# EAGLE design can_main_mb_v18_r4 (EAGLE 8.0.1)

## Sheet 1 of 2: can_main_mb_v18_r4
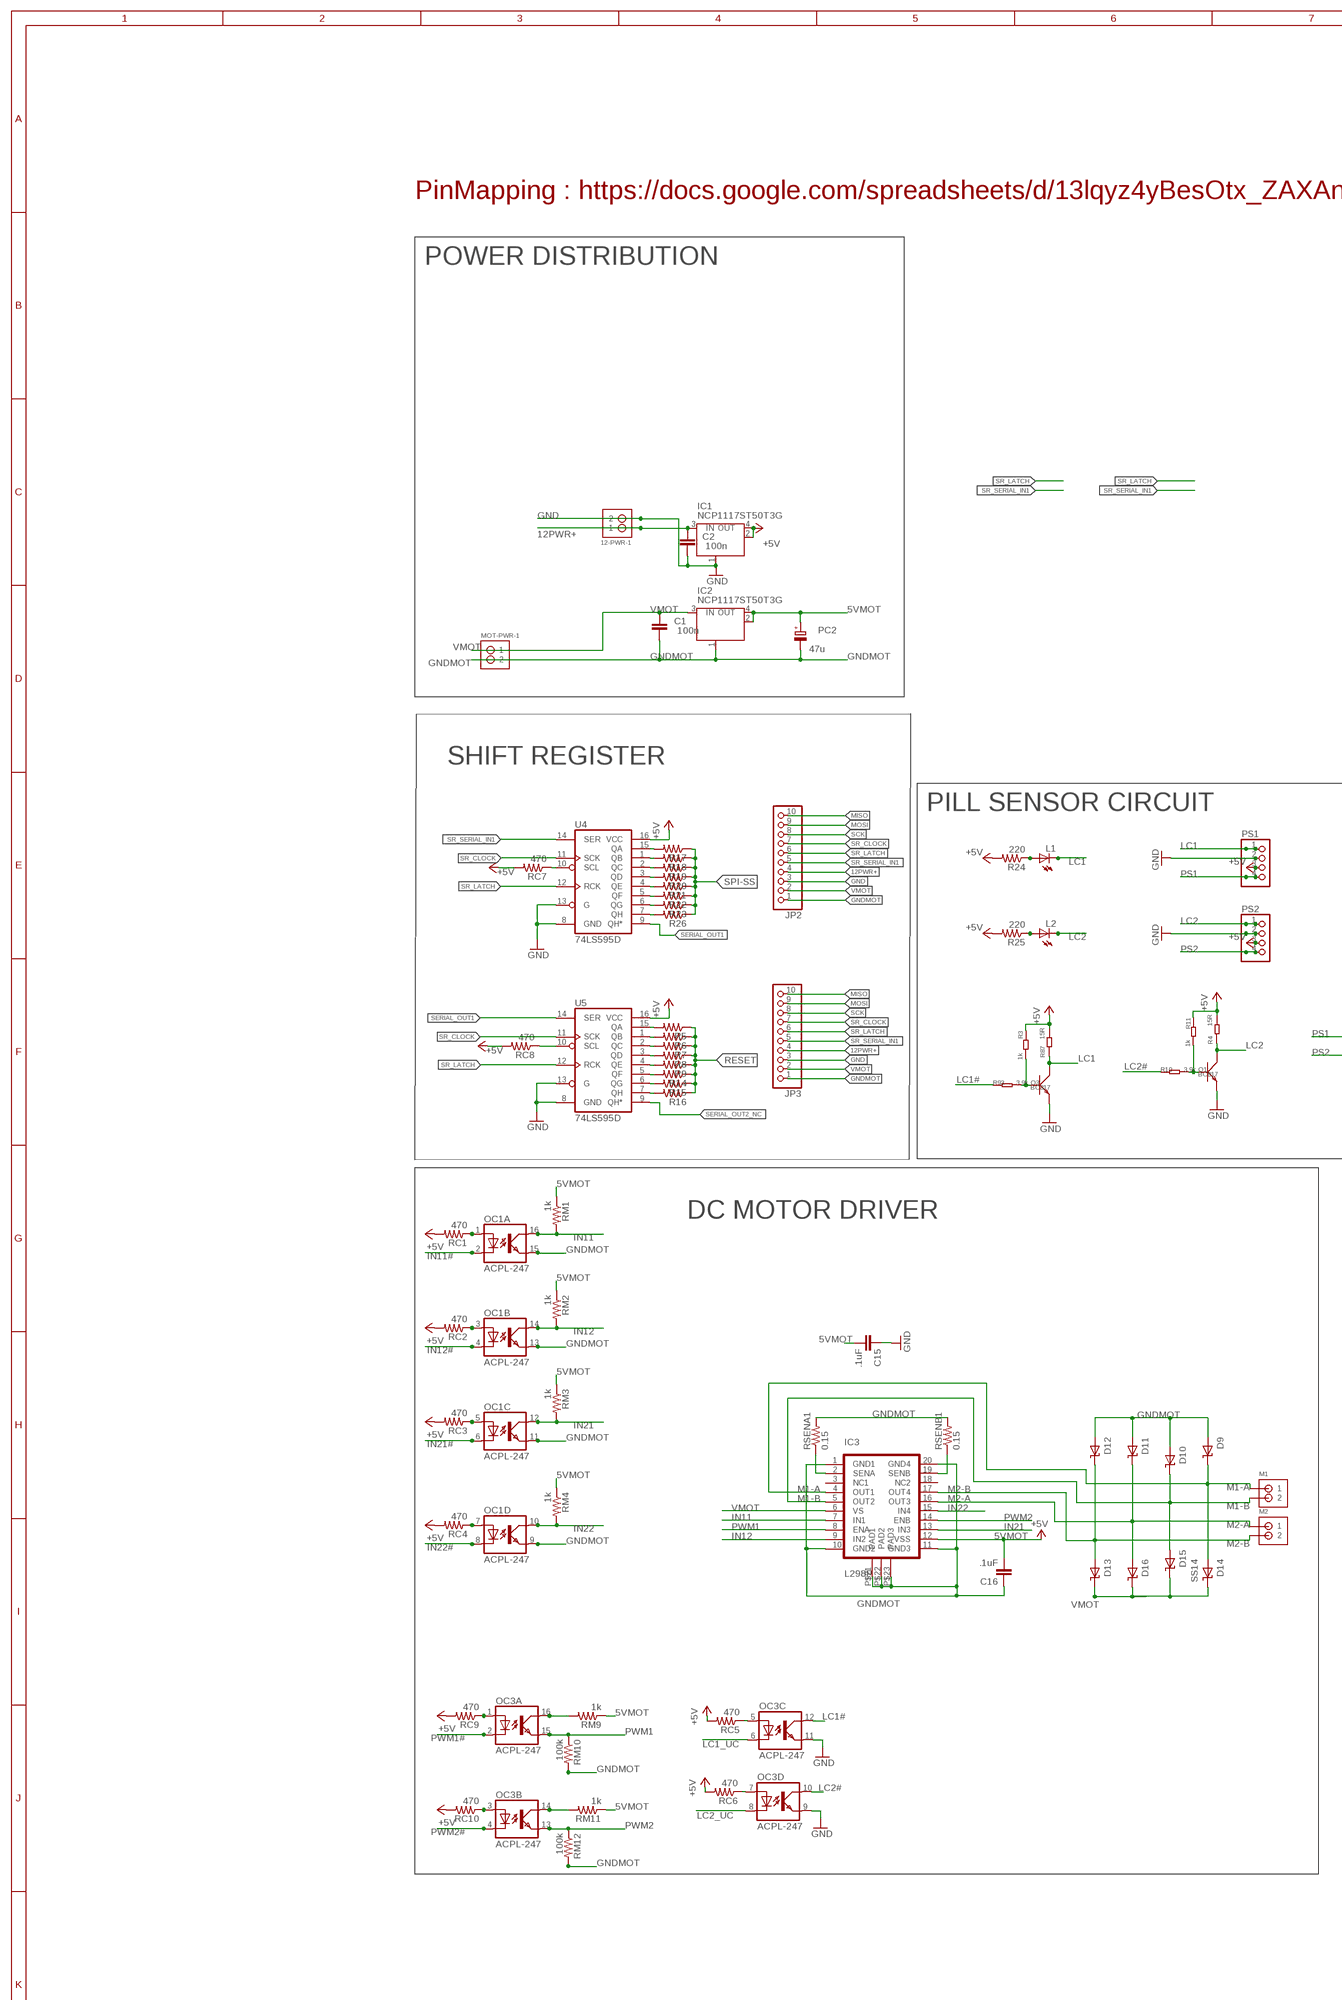
[diagram p0: schematic, sheet 1, part 1 of 3]
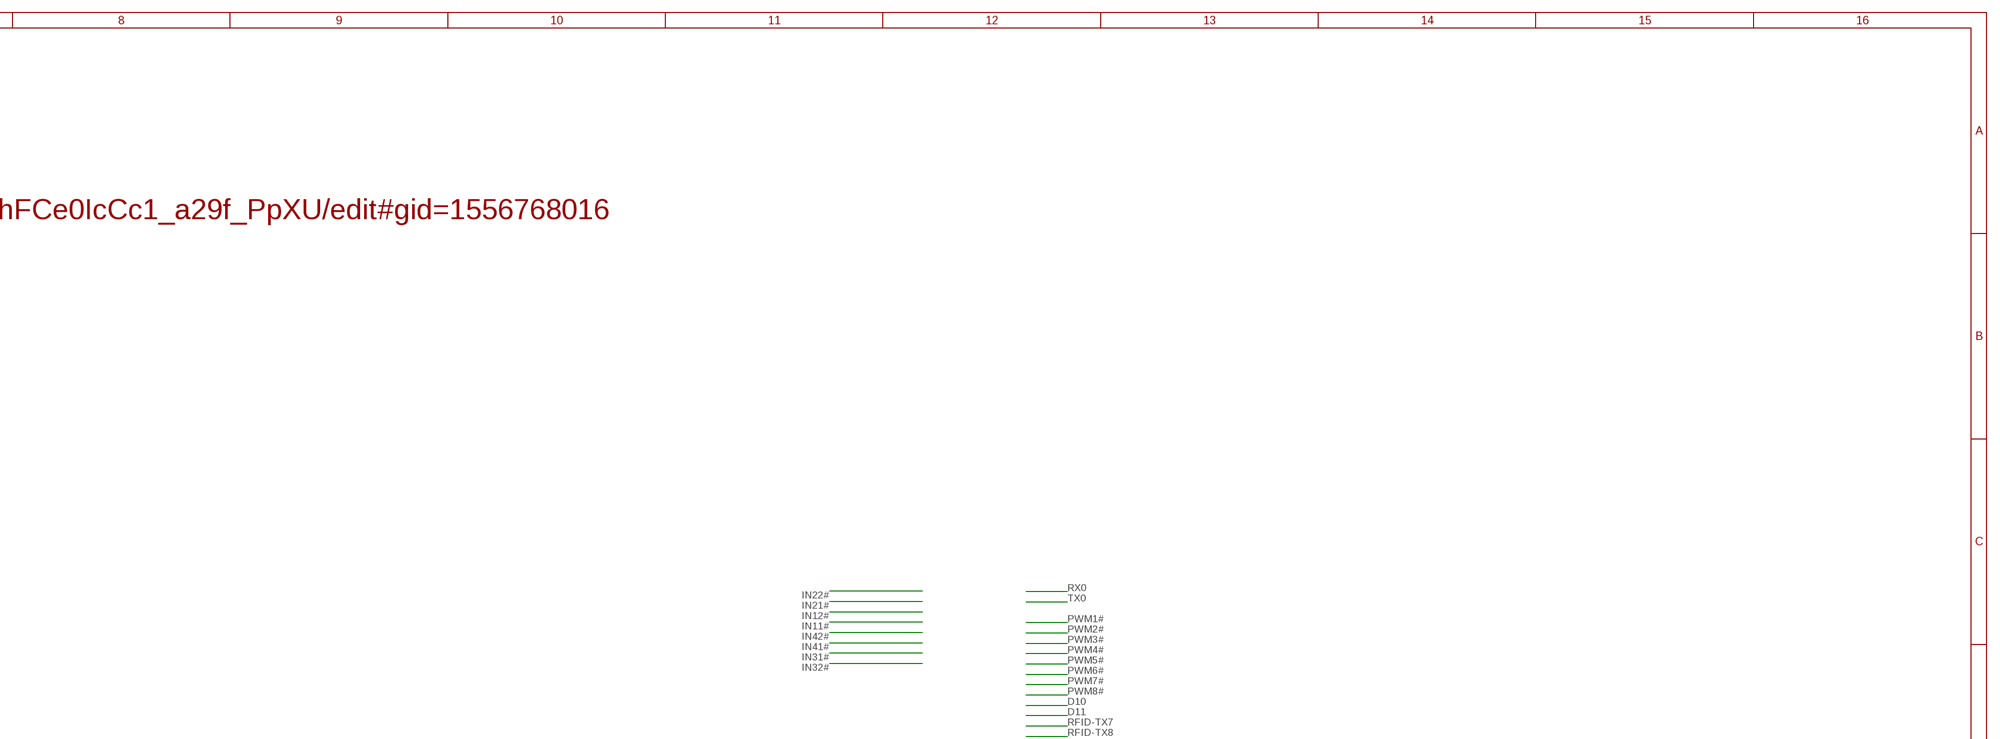
[diagram p1: schematic, sheet 1, part 2 of 3]
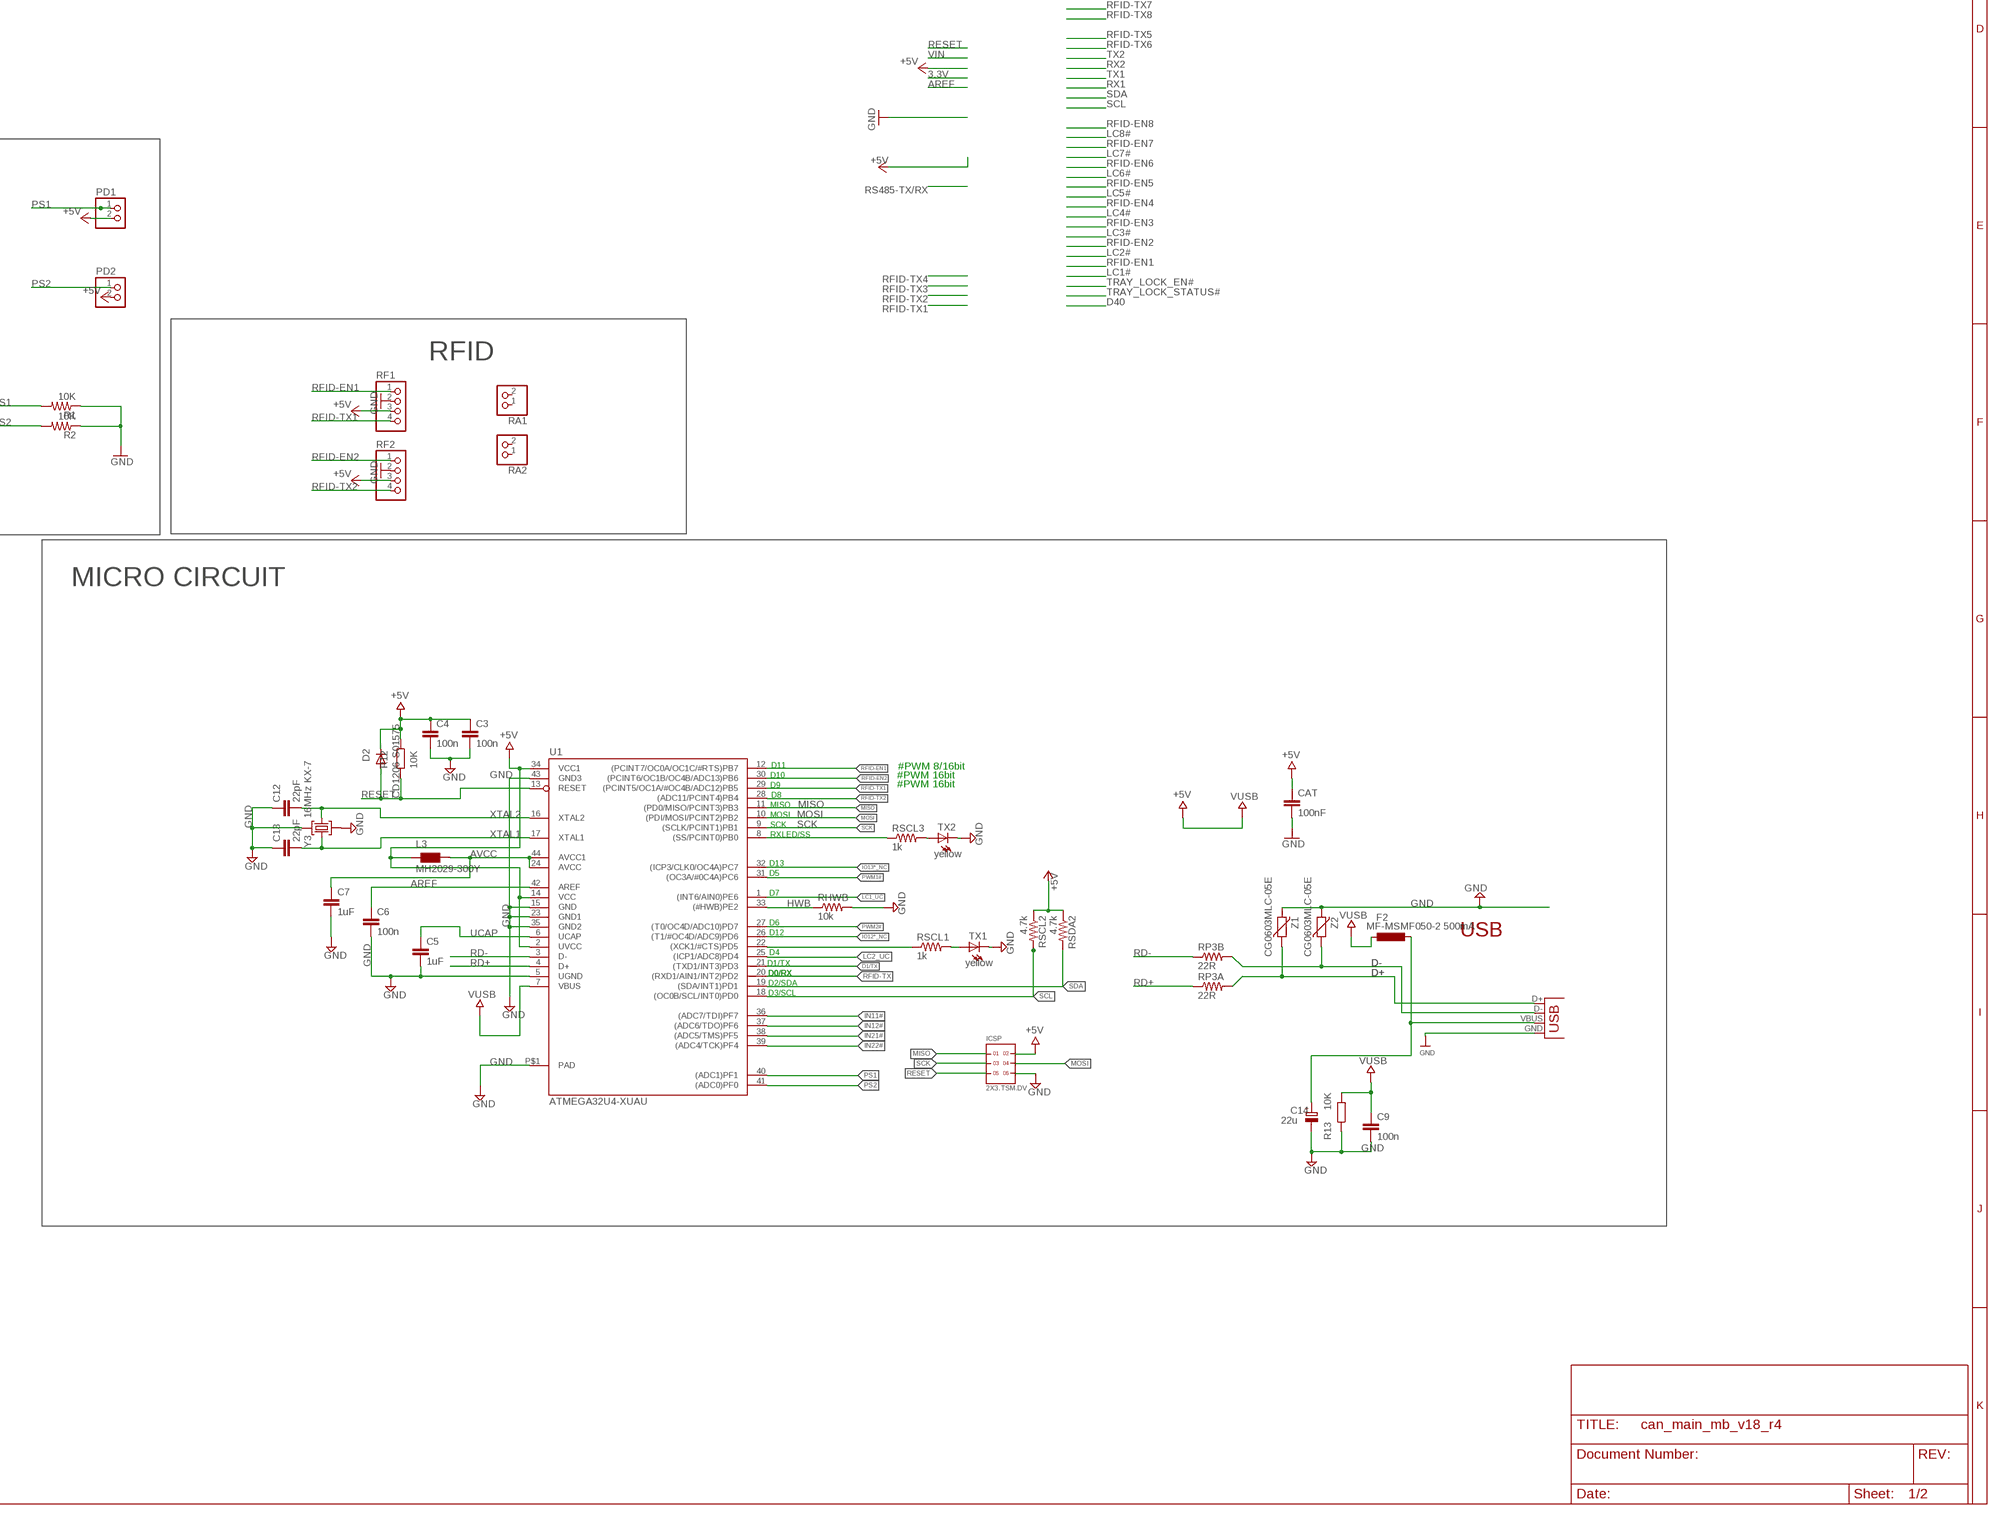
[diagram p2: schematic, sheet 1, part 3 of 3]

### Parts
12-PWR-1  JST-PH_2-PIN_HEADER  [JST_B2B-PH_HEADER]
C1  100n  C-EUC0603  [C0603]
C2  100n  C-EUC0603  [C0603]
C3  100n  C-EUC0603K  [C0603K]
C4  100n  C-EUC0603K  [C0603K]
C5  1uF  C-EUC0603K  [C0603K]
C6  100n  C-EUC0603K  [C0603K]
C7  1uF  C-EUC0603K  [C0603K]
C9  100n  C-EUC0603K  [C0603K]
C12  22pF  C-EUC0603K  [C0603K]
C13  22pF  C-EUC0603K  [C0603K]
C14  22u  CPOL-EUSMCC  [SMC_C]
C15  .1uF  CAP0402-CAP  [0402-CAP]
C16  .1uF  CAP0402-CAP  [0402-CAP]
CAT  100nF  CAP0603  [0603]
D2  CD1206-S01575  DIODE-MINIMELF  [MINIMELF]
D9  SS14  [SMA]
D10  SS14  [SMA]
D11  SS14  [SMA]
D12  SS14  [SMA]
D13  SS14  [SMA]
D14  SS14  [SMA]
D15  SS14  [SMA]
D16  SS14  [SMA]
F2  MF-MSMF050-2 500mA  L-EUL1812  [L1812]
IC1  NCP1117ST50T3G  MC33269ST-3.3T3  [SOT223]
IC2  NCP1117ST50T3G  MC33269ST-3.3T3  [SOT223]
IC3  L298P  [POWER-SO20]
ICSP  2X3.TSM.DV  [TSM-103-XX-XXX-DV-A]
JP1  USB  USBPTH-VERTICAL  [USB-B-PTH-VERTICAL]
JP2  PINHD-1X10  [1X10]
JP3  PINHD-1X10  [1X10]
L1  LED5MM  [LED5MM]
L2  LED5MM  [LED5MM]
L3  MH2029-300Y  WE-CBF_0805  [0805]
M1  JST-PH_2-PIN_HEADER  [JST_B2B-PH_HEADER]
M2  JST-PH_2-PIN_HEADER  [JST_B2B-PH_HEADER]
MOT-PWR-1  JST-PH_2-PIN_HEADER  [JST_B2B-PH_HEADER]
OC1  ACPL-247  [SOP16]
OC3  ACPL-247  [SOP16]
PC2  47u  CPOL-EUD  [PANASONIC_D]
PD1  PINHD-1X2  [1X02]
PD2  PINHD-1X2  [1X02]
PS1  PINHD-1X4  [1X04]
PS2  PINHD-1X4  [1X04]
Q1  BC817  TRANSISTOR-NPN-SOT23  [SOT23]
Q3  BC817  TRANSISTOR-NPN-SOT23  [SOT23]
R1  10K  R-US_R0603  [R0603]
R2  10K  R-US_R0603  [R0603]
R3  1k  R-0603  [R0603]
R4  15R  R-0603  [R0603]
R5  R-US_R0603  [R0603]
R6  R-US_R0603  [R0603]
R7  R-US_R0603  [R0603]
R8  R-US_R0603  [R0603]
R9  R-US_R0603  [R0603]
R10  3.9k  R-0603  [R0603]
R11  1k  R-0603  [R0603]
R12  10K  R-EU_R0603  [R0603-ROUND]
R13  10K  R-EU_R0603  [R0603-ROUND]
R14  R-US_R0603  [R0603]
R15  R-US_R0603  [R0603]
R16  R-US_R0603  [R0603]
R17  R-US_R0603  [R0603]
R18  R-US_R0603  [R0603]
R19  R-US_R0603  [R0603]
R20  R-US_R0603  [R0603]
R21  R-US_R0603  [R0603]
R22  R-US_R0603  [R0603]
R23  R-US_R0603  [R0603]
R24  220  R-US_R0603  [R0603]
R25  220  R-US_R0603  [R0603]
R26  R-US_R0603  [R0603]
R87  15R  R-0603  [R0603]
R93  3.9k  R-0603  [R0603]
RA1  PINHD-1X2  [1X02]
RA2  PINHD-1X2  [1X02]
RC1  470  R-US_R0603  [R0603]
RC2  470  R-US_R0603  [R0603]
RC3  470  R-US_R0603  [R0603]
RC4  470  R-US_R0603  [R0603]
RC5  470  R-US_R0603  [R0603]
RC6  470  R-US_R0603  [R0603]
RC7  470  R-US_R0603  [R0603]
RC8  470  R-US_R0603  [R0603]
RC9  470  R-US_R0603  [R0603]
RC10  470  R-US_R0603  [R0603]
RF1  PINHD-1X4  [1X04]
RF2  PINHD-1X4  [1X04]
RHWB  10k  R-US_R0603  [R0603]
RM1  1k  R-US_R0603  [R0603]
RM2  1k  R-US_R0603  [R0603]
RM3  1k  R-US_R0603  [R0603]
RM4  1k  R-US_R0603  [R0603]
RM9  1k  R-US_R0603  [R0603]
RM10  100k  R-US_R0603  [R0603]
RM11  1k  R-US_R0603  [R0603]
RM12  100k  R-US_R0603  [R0603]
RP3A  22R  R-US_R0603  [R0603]
RP3B  22R  R-US_R0603  [R0603]
RSCL1  1k  R-US_R0603  [R0603]
RSCL2  4.7k  R-US_R0603  [R0603]
RSCL3  1k  R-US_R0603  [R0603]
RSDA2  4.7k  R-US_R0603  [R0603]
RSENA1  0.15  R-US_R0603  [R0603]
RSENB1  0.15  R-US_R0603  [R0603]
TX1  yellow  LEDCHIPLED_0603  [CHIPLED_0603]
TX2  yellow  LEDCHIPLED_0603  [CHIPLED_0603]
U1  ATMEGA32U4-XUAU  [TQFP44-PAD]
U4  74LS595D  [SO16]
U5  74LS595D  [SO16]
Y3  16MHz KX-7  CRYSTAL-3.2-2.5  [CRYSTAL-3.2-2.5]
Z1  CG0603MLC-05E  VARISTORCN0603  [CT/CN0603]
Z2  CG0603MLC-05E  VARISTORCN0603  [CT/CN0603]

### Nets
5VMOT: C15.2 C16.2 IC2.2(OUT) IC2.4(OUT) IC3.P$12(VSS) PC2.+ RM1.1 RM2.1 RM3.1 RM4.1 RM9.1 RM11.1 ; supply symbol labelled +5V
12PWR+ [gnd]: 12-PWR-1.P1 C2.2 IC1.3(IN) JP2.4 JP3.4
+5V: C3.1 C4.1 C9.1 CAT.1 D2.C F2.2 IC1.2(OUT) IC1.4(OUT) ICSP.2 L3.1 PD1.2 PD2.2 PS1.3 PS2.3 R3.1 R4.2 R11.1 R12.1 R13.2 R24.2 R25.2 R87.2 RC1.2 RC2.2 RC3.2 RC4.2 RC5.2 RC6.2 RC7.2 RC8.2 RC9.2 RC10.2 RF1.3 RF2.3 RSCL2.1 RSDA2.1 U1.2(UVCC) U1.7(VBUS) U1.14(VCC) U1.34(VCC1) U4.16(VCC) U5.16(VCC) ; supply symbol labelled VUSB
AREF [motor]: C6.1 U1.42(AREF)
AVCC: C7.1 L3.2 U1.24(AVCC) U1.44(AVCC1)
D1/TX: U1.21((TXD1/INT3)PD3)
D+: JP1.D+ RP3A.2 Z1.1
D-: JP1.D- RP3B.2 Z2.1
GND [gnd]: 12-PWR-1.P2 C2.1 C3.2 C4.2 C5.2 C6.2 C7.2 C9.2 C12.1 C13.1 C14.- CAT.2 IC1.1(GND/ADJ) ICSP.6 JP1.GND JP2.3 JP3.3 OC3.9(D:EMIT) OC3.11(C:EMIT) PS1.2 PS2.2 Q1.2(E) Q3.2(E) R1.1 R2.1 R13.1 RF1.2 RF2.2 RHWB.2 TX1.C TX2.C U1.5(UGND) U1.15(GND) U1.23(GND1) U1.35(GND2) U1.43(GND3) U1.P$1(PAD) U4.8(GND) U4.13(G) U5.8(GND) U5.13(G) Y3.2(GND) Y3.4(GND) Z1.2 Z2.2
GNDMOT [gnd]: C1.1 C15.1 C16.1 D9.P$2(A) D10.P$2(A) D11.P$2(A) D12.P$2(A) IC2.1(GND/ADJ) IC3.P$1(GND1) IC3.P$10(GND2) IC3.P$11(GND3) IC3.P$20(GND4) IC3.P$21(PAD1) IC3.P$22(PAD2) IC3.P$23(PAD3) JP2.1 JP3.1 MOT-PWR-1.P2 OC1.9(D:EMIT) OC1.11(C:EMIT) OC1.13(B:EMIT) OC1.15(A:EMIT) PC2.- RM10.2 RM12.2 RSENA1.2 RSENB1.2 ; supply symbol labelled GND
HWB: RHWB.1 U1.33((#HWB)PE2)
IN11: IC3.P$7(IN1) OC1.16(A:COL) RM1.2
IN11#: OC1.2(A:C) U1.36((ADC7/TDI)PF7)
IN12: IC3.P$9(IN2) OC1.14(B:COL) RM2.2
IN12#: OC1.4(B:C) U1.37((ADC6/TDO)PF6)
IN21: IC3.P$13(IN3) OC1.12(C:COL) RM3.2
IN21#: OC1.6(C:C) U1.38((ADC5/TMS)PF5)
IN22: IC3.P$15(IN4) OC1.10(D:COL) RM4.2
IN22#: OC1.8(D:C) U1.39((ADC4/TCK)PF4)
IO12*_NC: U1.26((T1/#OC4D/ADC9)PD6)
IO13*_NC: U1.32((ICP3/CLK0/OC4A)PC7)
LC1: L1.K(C) PS1.1 Q3.3(C) R87.1
LC1#: OC3.12(C:COL) R93.1
LC1_UC: OC3.6(C:C) U1.1((INT6/AIN0)PE6)
LC2: L2.K(C) PS2.1 Q1.3(C) R4.1
LC2#: OC3.10(D:COL) R10.1
LC2_UC: OC3.8(D:C) U1.25((ICP1/ADC8)PD4)
M1-A [motor]: D9.P$1(K) D14.P$2(A) IC3.P$4(OUT1) M1.P1
M1-B [motor]: D10.P$1(K) D15.P$2(A) IC3.P$5(OUT2) M1.P2
M2-A [motor]: D11.P$1(K) D16.P$2(A) IC3.P$16(OUT3) M2.P1
M2-B [motor]: D12.P$1(K) D13.P$2(A) IC3.P$17(OUT4) M2.P2
MISO: ICSP.1 JP2.10 JP3.10 U1.11((PD0/MISO/PCINT3)PB3)
MOSI: ICSP.4 JP2.9 JP3.9 U1.10((PDI/MOSI/PCINT2)PB2)
N$1: OC1.3(B:A) RC2.1
N$2: OC1.5(C:A) RC3.1
N$3: OC3.5(C:A) RC5.1
N$4: OC1.7(D:A) RC4.1
N$5: RC8.1 U5.10(SCL)
N$6: OC3.7(D:A) RC6.1
N$7: Q1.1(B) R10.2 R11.2
N$8: RC7.1 U4.10(SCL)
N$9: OC3.1(A:A) RC9.1
N$10: OC3.3(B:A) RC10.1
N$11: RSCL1.1 U1.22((XCK1/#CTS)PD5)
N$12: R5.2 U5.15(QA)
N$13: L1.A R24.1
N$14: R6.2 U5.1(QB)
N$15: R7.2 U5.2(QC)
N$16: R8.2 U5.3(QD)
N$17: R16.2 U5.7(QH)
N$18: RSCL1.2 TX1.A
N$19: RSCL3.2 TX2.A
N$20: R15.2 U5.6(QG)
N$21: R9.2 U5.4(QE)
N$22: R17.2 U4.15(QA)
N$23: R18.2 U4.1(QB)
N$24: R19.2 U4.2(QC)
N$25: R20.2 U4.3(QD)
N$26: R26.2 U4.7(QH)
N$27: R23.2 U4.6(QG)
N$28: R21.2 U4.4(QE)
N$29: R14.2 U5.5(QF)
N$51: L2.A R25.1
N$56: OC3.16(A:COL) RM9.2
N$57: OC3.14(B:COL) RM11.2
N$117: OC1.1(A:A) RC1.1
N$317: Q3.1(B) R3.2 R93.2
PS1: PD1.1 PS1.4 R1.2 U1.40((ADC1)PF1)
PS2: PD2.1 PS2.4 R2.2 U1.41((ADC0)PF0)
PWM1: IC3.P$8(ENA) OC3.15(A:EMIT) RM10.1
PWM1#: OC3.2(A:C) U1.31((OC3A/#0C4A)PC6)
PWM2: IC3.P$14(ENB) OC3.13(B:EMIT) RM12.1
PWM2#: OC3.4(B:C) U1.27((T0/OC4D/ADC10)PD7)
RD+: RP3A.1 U1.4(D+)
RD-: RP3B.1 U1.3(D-)
RESET: D2.A ICSP.5 R5.1 R6.1 R7.1 R8.1 R9.1 R12.2 R14.1 R15.1 R16.1 U1.13(RESET)
RESET1: R22.2 U4.5(QF)
RFID-EN1: RF1.1 U1.12((PCINT7/OC0A/OC1C/#RTS)PB7)
RFID-EN2: RF2.1 U1.30((PCINT6/OC1B/OC4B/ADC13)PB6)
RFID-TX: U1.20((RXD1/AIN1/INT2)PD2)
RFID-TX1: RF1.4 U1.29((PCINT5/OC1A/#OC4B/ADC12)PB5)
RFID-TX2: RF2.4 U1.28((ADC11/PCINT4)PB4)
SCK: ICSP.3 JP2.8 JP3.8 U1.9((SCLK/PCINT1)PB1)
SCL: RSCL2.2 U1.18((OC0B/SCL/INT0)PD0)
SDA: RSDA2.2 U1.19((SDA/INT1)PD1)
SERIAL_OUT1: U4.9(QH*) U5.14(SER)
SERIAL_OUT2_NC: U5.9(QH*)
SNSA: IC3.P$2(SENA) RSENA1.1
SNSB: IC3.P$19(SENB) RSENB1.1
SPI-SS: R17.1 R18.1 R19.1 R20.1 R21.1 R22.1 R23.1 R26.1 RSCL3.1 U1.8((SS/PCINT0)PB0)
SR_CLOCK: JP2.7 JP3.7 U4.11(SCK) U5.11(SCK)
SR_LATCH: JP2.6 JP3.6 U4.12(RCK) U5.12(RCK)
SR_SERIAL_IN1: JP2.5 JP3.5 U4.14(SER)
UCAP: C5.1 U1.6(UCAP)
VMOT [0.6096]: C1.2 D13.P$1(K) D14.P$1(K) D15.P$1(K) D16.P$1(K) IC2.3(IN) IC3.P$6(VS) JP2.2 JP3.2 MOT-PWR-1.P1
VUSBD: C14.+ F2.1 JP1.VBUS
XTAL1: C13.2 U1.17(XTAL1) Y3.3(C2)
XTAL2: C12.2 U1.16(XTAL2) Y3.1(C1)
Unconnected: IC3.P$3(NC1) IC3.P$18(NC2) RA1.1 RA1.2 RA2.1 RA2.2

### Notes on the sheet
- PinMapping : https://docs.google.com/spreadsheets/d/13lqyz4yBesOtx_ZAXAn3Kk6hFCe0IcCc1_a29f_PpXU/edit#gid=1556768016
- POWER DISTRIBUTION
- SHIFT REGISTER
- PILL SENSOR CIRCUIT
- RFID
- MICRO CIRCUIT
- DC MOTOR DRIVER
- D11 | #PWM 8/16bit
- D10 | #PWM 16bit
- D9 | #PWM 16bit
- D8
- MISO
- MOSI
- SCK
- RXLED/SS
- D13
- D5
- D7
- D6
- D12 | USB
- D4
- D1/TX
- D0/RX | D0/RX
- D2/SDA
- D3/SCL

## Sheet 2 of 2: Notes
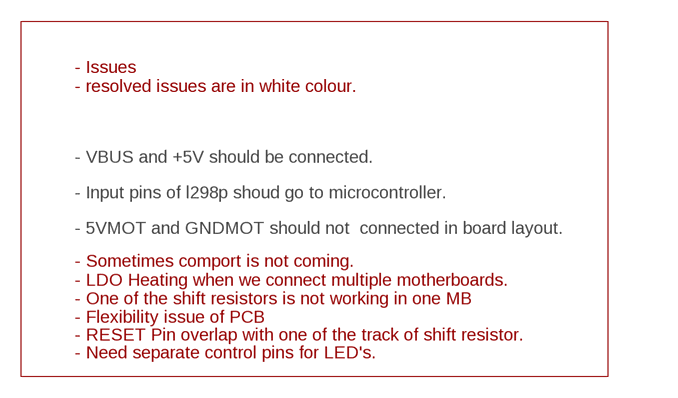
[diagram p3: schematic, sheet 2]

### Notes on the sheet
- - Issues
  - resolved issues are in white colour.
- - VBUS and +5V should be connected.
- - Input pins of l298p shoud go to microcontroller.
- - 5VMOT and GNDMOT should not  connected in board layout.
- - Sometimes comport is not coming.
  - LDO Heating when we connect multiple motherboards.
  - One of the shift resistors is not working in one MB
  - Flexibility issue of PCB
- - RESET Pin overlap with one of the track of shift resistor.
- - Need separate control pins for LED's.

## Library data of the parts
12-PWR-1 M1 M2 MOT-PWR-1 = SRG:JST-PH_2-PIN_HEADER: 2-pin JST PH Shrouded Header, top entry P/N B2B-PH-K-S Mating connector PHR-2 Mating cable assembly: Sparkfun PRT-09914 <http://www.sparkfun.com/products/9914>
C1 C2 = rcl:C-EU: CAPACITOR, European symbol
C3-C7 C9 C12 C13 = SmartPrj:C-EU: CAPACITOR, European symbol
C14 PC2 = rcl:CPOL-EU: POLARIZED CAPACITOR, European symbol
C15 C16 = SparkFun-Passives:CAP: Capacitor Standard 0603 ceramic capacitor, and 0.1" leaded capacitor.
CAT = SparkFun:CAP: Capacitor Standard 0603 ceramic capacitor, and 0.1" leaded capacitor.
D2 = diode:DIODE-: DIODE
D9-D16 = SmartPrj:SS14: DIODE SS14 Diode Schottky 1A 40v
F2 = rcl:L-EU: INDUCTOR, European symbol
IC1 IC2 = linear:MC33269ST*: Adjustable Output Low Dropout Voltage Regulator 800 mA Source: http://www.onsemi.com/pub/Collateral/MC33269-D.PDF
IC3 = SmartPrj:L298P: L298P DUAL FUL-BRIDGE DRIVER PowerSO20
ICSP = headers_samtec:2X3
JP1 = SparkFun-Connectors:USB: USB Connectors USB-B-PTH is fully proven SKU : PRT-00139/CONN-08278 USB-miniB is fully proven SKU : PRT-00587 USB-A-PCB is untested. USB-A-H is throughly reviewed, but untested. Spark Fun Electronics SKU : PRT-00437 USB-B-SMT is throughly reviewed, but untested. Needs silkscreen touching up. USB-A-S has not been used/tested USB-MB-H has not been used/tested USB-MICROB has been used. CONN-09505
JP2 JP3 = pinhead:PINHD-1X10: PIN HEADER
L1 L2 TX1 TX2 = led:LED: LED OSRAM: - CHIPLED LG R971, LG N971, LY N971, LG Q971, LY Q971, LO R971, LY R971 LH N974, LH R974 LS Q976, LO Q976, LY Q976 LO Q996 - Hyper CHIPLED LW Q18S LB Q993, LB Q99A, LB R99A - SideLED LS A670, LO A670, LY A670, LG A670, LP A670 LB A673, LV A673, LT A673, LW A673 LH A674 LY A675 LS A676, LA A676, LO A676, LY A676, LW A676 LS A679, LY A679, LG A679 - Hyper Micro SIDELED® LS Y876, LA Y876, LO Y876, LY Y876 LT Y87S - SmartLED LW L88C, LW L88S LB L89C, LB L89S, LG L890 LS L89K, LO L89K, LY L89K LS L896, LA L896, LO L896, LY L896 - TOPLED LS T670, LO T670, LY T670, LG T670, LP T670 LSG T670, LSP T670, LSY T670, LOP T670, LYG T670 LG T671, LOG T671, LSG T671 LB T673, LV T673, LT T673, LW T673 LH T674 LS T676, LA T676, LO T676, LY T676, LB T676, LH T676, LSB T676, LW T676 LB T67C, LV T67C, LT T67C, LS T67K, LO T67K, LY T67K, LW E67C LS E67B, LA E67B, LO E67B, LY E67B, LB E67C, LV E67C, LT E67C LW T67C LS T679, LY T679, LG T679 LS T770, LO T770, LY T770, LG T770, LP T770 LB T773, LV T773, LT T773, LW T773 LH T774 LS E675, LA E675, LY E675, LS T675 LS T776, LA T776, LO T776, LY T776, LB T776 LHGB T686 LT T68C, LB T68C - Hyper Mini TOPLED® LB M676 - Mini TOPLED Santana® LG M470 LS M47K, LO M47K, LY M47K Source: http://www.osram.convergy.de LUXEON: - LUMILED® LXK2-PW12-R00, LXK2-PW12-S00, LXK2-PW14-U00, LXK2-PW14-V00 LXK2-PM12-R00, LXK2-PM12-S00, LXK2-PM14-U00 LXK2-PE12-Q00, LXK2-PE12-R00, LXK2-PE12-S00, LXK2-PE14-T00, LXK2-PE14-U00 LXK2-PB12-K00, LXK2-PB12-L00, LXK2-PB12-M00, LXK2-PB14-N00, LXK2-PB14-P00, LXK2-PB14-Q00 LXK2-PR12-L00, LXK2-PR12-M00, LXK2-PR14-Q00, LXK2-PR14-R00 LXK2-PD12-Q00, LXK2-PD12-R00, LXK2-PD12-S00 LXK2-PH12-R00, LXK2-PH12-S00 LXK2-PL12-P00, LXK2-PL12-Q00, LXK2-PL12-R00 Source: www.luxeon.com KINGBRIGHT: KA-3528ASYC Source: www.kingbright.com
L3 = wuerth-elektronik:WE-CBF: SMD EMI Suppression Ferrite Beads - excellent anti-EMI properties - low DCR - impedances till 3000 ohms - rated current up to 6 A
OC1 OC3 = avago:ACPL-247
PD1 PD2 RA1 RA2 = pinhead:PINHD-1X2: PIN HEADER
PS1 PS2 RF1 RF2 = pinhead:PINHD-1X4: PIN HEADER
Q1 Q3 = Discrete:TRANSISTOR-NPN*: NPN audion
R1 R2 R5-R9 R14-R26 RC1-RC10 RHWB RM1-RM4 RM9-RM12 RP3A RP3B RSCL1-RSCL3 RSDA2 RSENA1 RSENB1 = resistor:R-US_: RESISTOR, American symbol
R3 R4 R10 R11 R87 R93 = Discrete:R*
R12 R13 = SmartPrj:R-EU_: RESISTOR, European symbol
U1 = SmartPrj:ATMEGA32U4-XU
U4 U5 = SparkFun:74*595: 8-bit SHIFT REGISTER, output latch
Y3 = SmartPrj:CRYSTAL-3.2-2.5
Z1 Z2 = varistor:VARISTOR: VARISTOR

## Net classes
0 default: width 0.254 mm, drill 0.254 mm, clearance 0.203 mm
1 power: width 0.635 mm, drill 0.584 mm, clearance 0.305 mm
2 gnd: width 0.406 mm, drill 0.305 mm, clearance 0.254 mm
3 power usb: width 0.508 mm, drill 0.406 mm, clearance 0.203 mm
4 motor: width 0.305 mm, drill 0.254 mm, clearance 0.203 mm
5 0.6096: width 0.61 mm, drill 0.406 mm, clearance 0.305 mm

## Board
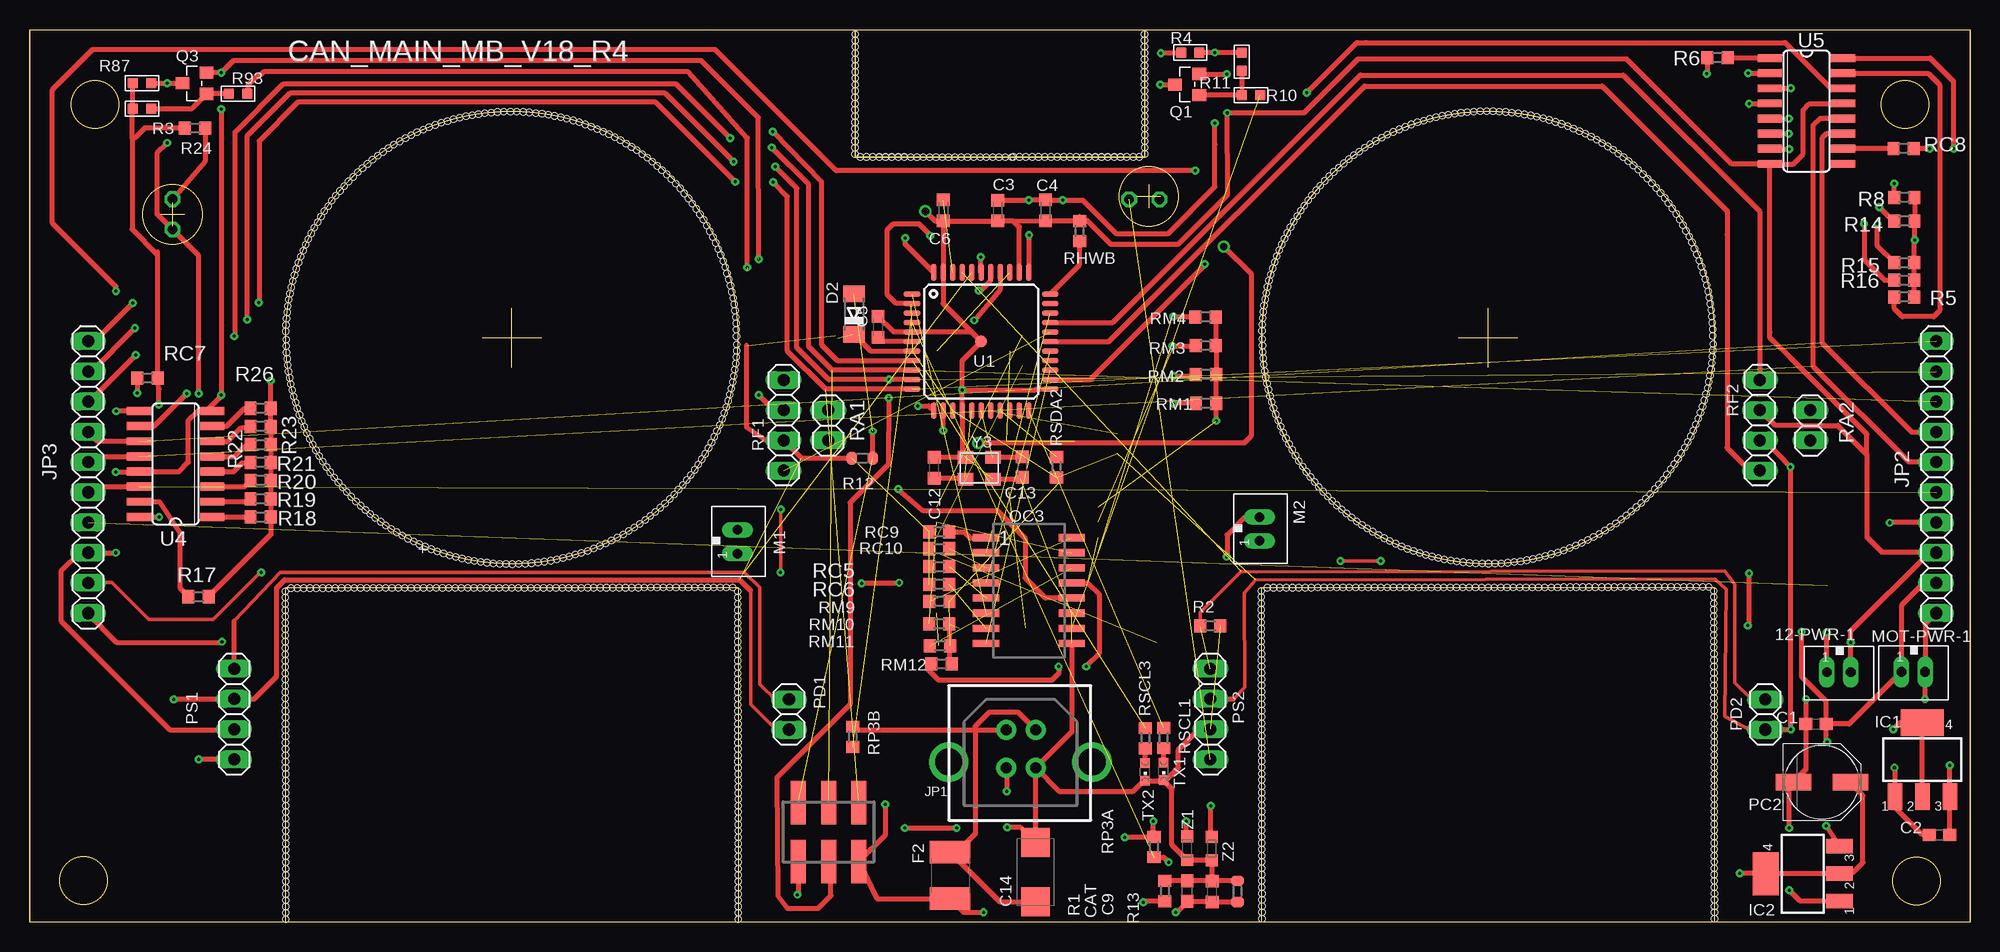
[diagram p4: board, top side]
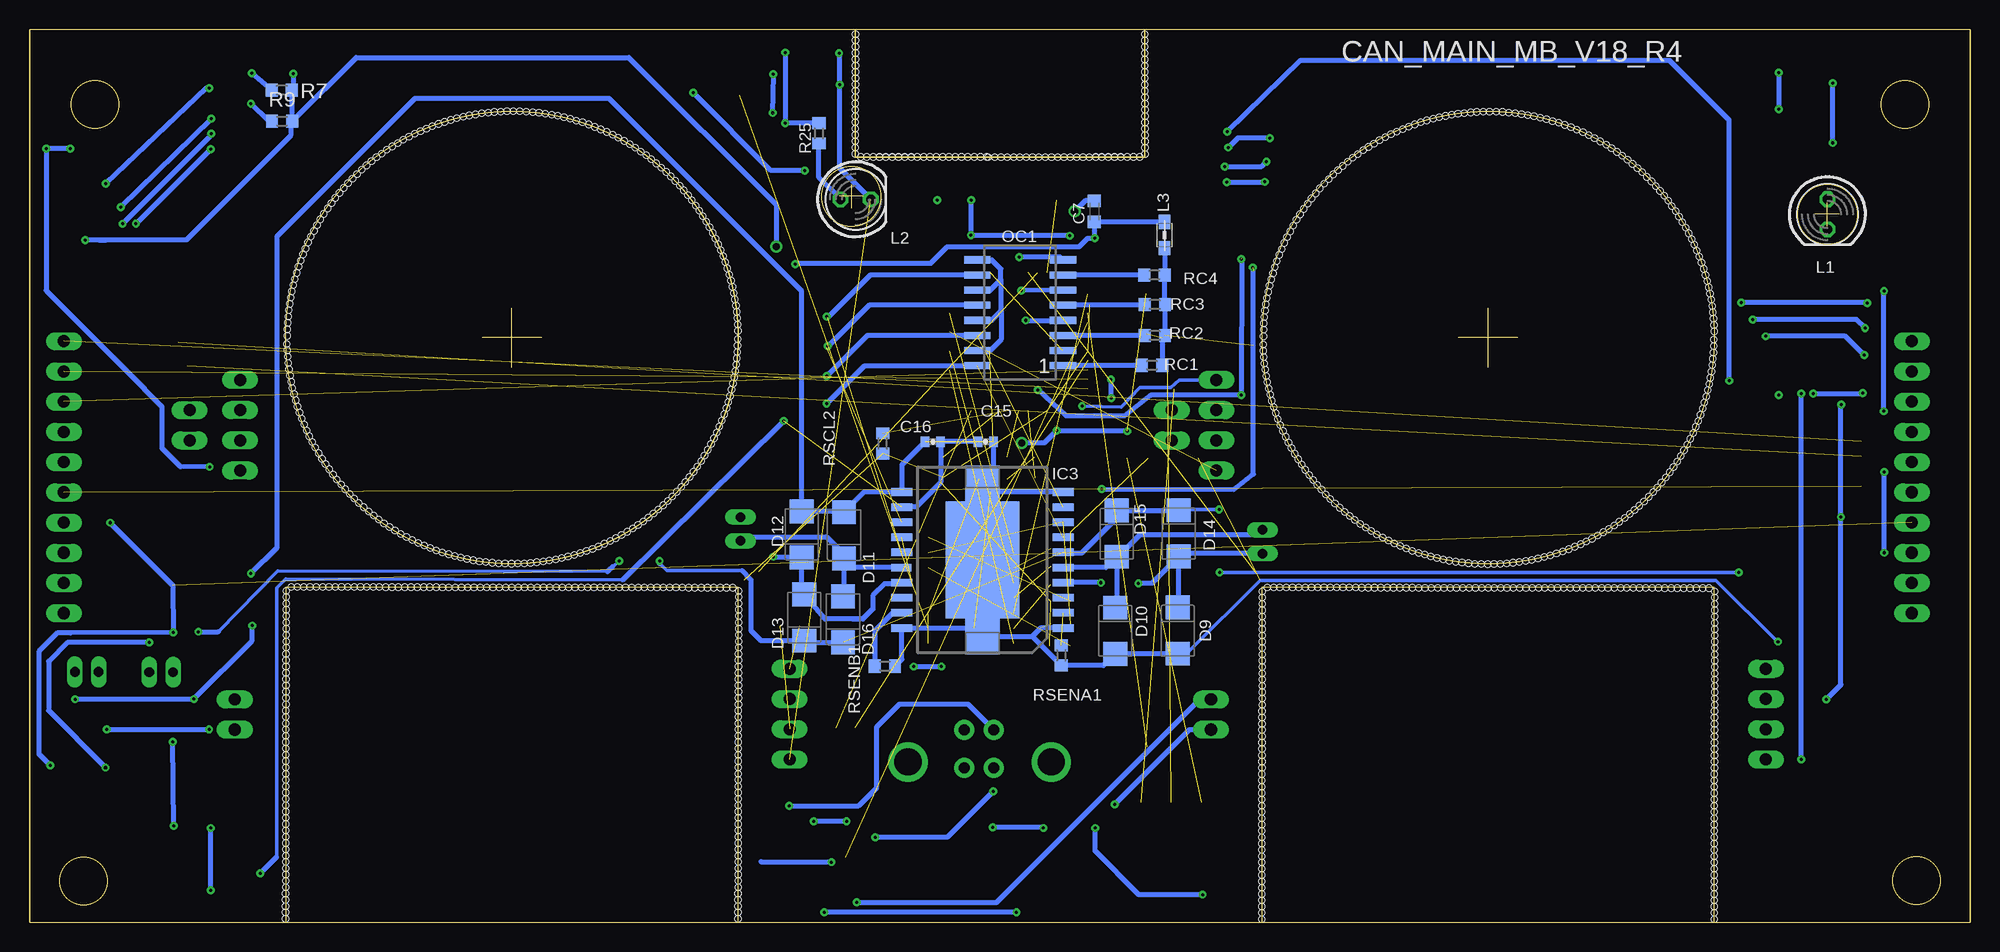
[diagram p5: board, bottom side, seen from below]

Size 163 x 75 mm. Coordinates in mm from the lower left corner, seen from the top.
Outline: 40.5,46.62 40.5,51.62
Outline: 38,49.12 43,49.12
Outline: 120,49.12 125,49.12
Outline: 122.5,46.62 122.5,51.62
Outline: 2.5,75 69.33,75
Outline: 69.33,75 93.64,75
Outline: 93.64,75 162.5,75
Outline: 162.5,0 59.5,0
Outline: 59.5,0 21.5,0
Outline: 21.5,0 2.5,0
Outline: 21.5,0 21.5,28.13 59.5,28.13 59.5,0
Outline: 103.5,0 103.5,28.13 141.5,28.13 141.5,0
Outline: 69.33,75 69.33,64.31 93.64,64.31 93.64,75
Outline: 93.67,75 163,75
Outline: 163,0 163,75
Outline: 163,0 141.5,0
Outline: 141.5,28.13 141.5,0
Outline: 103.5,28.13 141.5,28.13
Outline: 103.5,0 103.5,28.13
Outline: 103.5,0 59.5,0
Outline: 59.5,28.13 59.5,0
Outline: 21.5,28.13 59.5,28.13
Outline: 21.5,0 21.5,28.13
Outline: 21.5,0 0,0
Outline: 0,75 0,0
Outline: 0,75 69.36,75
Outline: 69.36,64.31 69.36,75
Outline: 93.67,64.31 69.36,64.31
Outline: 93.67,75 93.67,64.31
Outline: 93.67,75 163,75
Outline: 163,0 163,75
Outline: 163,0 141.5,0
Outline: 141.5,28.13 141.5,0
Outline: 103.5,28.13 141.5,28.13
Outline: 103.5,0 103.5,28.13
Outline: 103.5,0 59.5,0
Outline: 59.5,28.13 59.5,0
Outline: 21.5,28.13 59.5,28.13
Outline: 21.5,0 21.5,28.13
Outline: 21.5,0 0,0
Outline: 0,75 0,0
Outline: 0,75 69.36,75
Outline: 69.36,64.31 69.36,75
Outline: 93.67,64.31 69.36,64.31
Outline: 93.67,75 93.67,64.31
Outline: 21.5,0 0,0
Outline: 0,75 0,0
Outline: 0,75 69.36,75
Outline: 69.36,64.31 69.36,75
Outline: 93.67,64.31 69.36,64.31
Outline: 93.67,75 93.67,64.31
Outline: 93.67,75 163,75
Outline: 163,75 163,0
Outline: 163,0 141.5,0
Outline: 141.5,28.13 141.5,0
Outline: 103.5,28.13 141.5,28.13
Outline: 103.5,0 103.5,28.13
Outline: 103.5,0 59.5,0
Outline: 59.5,28.13 59.5,0
Outline: 21.5,28.13 59.5,28.13
Outline: 21.5,0 21.5,28.13
Outline: 93.67,75 163,75 163,0 141.5,0 141.5,28.13 103.5,28.13 103.5,0 59.5,0 59.5,28.13 21.5,28.13 21.5,0 0,0 0,75 69.36,75 69.36,64.31 93.67,64.31 93.67,75
Outline: 93.67,75 163,75 163,0 141.5,0 141.5,28.13 103.5,28.13 103.5,0 59.5,0 59.5,28.13 21.5,28.13 21.5,0 0,0 0,75 69.36,75 69.36,64.31 93.67,64.31 93.67,75
Outline: circle at 122.5,49.12 radius 19
Outline: circle at 40.5,49.12 radius 19
Outline: circle at 122.5,49.13 radius 19
Outline: circle at 40.5,49.13 radius 19
Outline: circle at 122.5,49.13 radius 19
Outline: circle at 40.5,49.13 radius 19
Outline: circle at 40.5,49.13 radius 19
Outline: circle at 122.5,49.13 radius 19
Outline: circle at 122.5,49.13 radius 19
Outline: circle at 40.5,49.13 radius 19
Outline: circle at 4.5,3.5 radius 2
Outline: circle at 158.5,3.47 radius 2
Outline: circle at 157.53,68.72 radius 2
Outline: circle at 122.5,49.13 radius 19
Outline: circle at 40.5,49.13 radius 19
Outline: circle at 5.47,68.72 radius 2
Outline: circle at 122.5,49.13 radius 19
Outline: circle at 40.5,49.13 radius 19
Outline: circle at 4.5,3.5 radius 2
Outline: circle at 158.5,3.47 radius 2
Copper layers (1*2*3*16): Top 0.035mm / dielectric 0.2mm / Route2 0.035mm / dielectric 0.15mm / Route3 0.035mm / dielectric 0.2mm / Bottom 0.035mm
Design rules "meditab *": minimum track width 7mil, minimum drill 7mil, track to track 7mil, track to pad 7mil, pad to pad 7mil, via to via 7mil, smd to smd 7mil, copper to edge 7mil, drill to drill 7mil, minimum pad ring 10mil, minimum via ring 8mil, stop-mask expansion 4mil, vias tented up to drill 0mil, thermal gap 10mil
Holes 0.5 mm at 21.51,0.25 21.51,0.78 21.51,1.31 21.51,1.84 21.51,2.37 21.5,2.9 21.5,3.43 21.5,3.96 21.5,4.49 21.5,5.02 21.5,5.55 21.5,6.08 21.5,6.61 21.5,7.14 21.5,7.67 21.49,8.2 21.49,8.73 21.49,9.26 21.49,9.79 21.49,10.32 21.49,10.85 21.49,11.38 21.49,11.91 21.49,12.44 21.48,12.97 21.48,13.5 21.48,14.03 21.48,14.56 21.48,15.09 21.48,15.62 21.48,16.15 21.48,16.68 21.48,17.21 21.48,17.74 21.47,18.27 21.47,18.8 21.47,19.33 21.47,19.86 21.47,20.39 21.47,20.92 21.47,21.45 21.47,21.98 21.47,22.51 21.46,23.04 21.46,23.57 21.46,24.1 21.46,24.63 21.46,25.16 21.46,25.69 21.46,26.22 21.46,26.75 21.46,27.28 21.46,27.81 59.52,0.25 59.52,0.78 59.52,1.31 59.52,1.84 59.52,2.37 59.51,2.9 59.51,3.43 59.51,3.96 59.51,4.49 59.51,5.02 59.51,5.55 59.51,6.08 59.51,6.61 59.51,7.14 59.51,7.67 59.5,8.2 59.5,8.73 59.5,9.26 59.5,9.79 59.5,10.32 59.5,10.85 59.5,11.38 59.5,11.91 59.5,12.44 59.49,12.97 59.49,13.5 59.49,14.03 59.49,14.56 59.49,15.09 59.49,15.62 59.49,16.15 59.49,16.68 59.49,17.21 59.49,17.74 59.48,18.27 59.48,18.8 59.48,19.33 59.48,19.86 59.48,20.39 59.48,20.92 59.48,21.45 59.48,21.98 59.48,22.51 59.47,23.04 59.47,23.57 59.47,24.1 59.47,24.63 59.47,25.16 59.47,25.69 59.47,26.22 59.47,26.75 59.47,27.28 59.47,27.81 59.05,28.13 58.52,28.13 57.99,28.13 57.46,28.13 56.93,28.13 56.4,28.12 55.87,28.12 55.34,28.12 54.81,28.12 54.28,28.12 53.75,28.12 53.22,28.12 52.69,28.12 52.16,28.12 51.63,28.12 51.1,28.11 50.57,28.11 50.04,28.11 49.51,28.11 48.98,28.11 48.45,28.11 47.92,28.11 47.39,28.11 46.86,28.11 46.33,28.1 45.8,28.1 45.27,28.1 44.74,28.1 44.21,28.1 43.68,28.1 43.15,28.1 42.62,28.1 42.09,28.1 41.56,28.1 41.03,28.09 40.5,28.09 39.97,28.09 39.44,28.09 38.91,28.09 38.38,28.09 37.85,28.09 37.32,28.09 36.79,28.09 36.26,28.08 35.73,28.08 35.2,28.08 34.67,28.08 34.14,28.08 33.61,28.08 33.08,28.08 32.55,28.08 32.02,28.08 31.49,28.08 23.01,28.07 23.54,28.07 24.07,28.07 24.6,28.07 25.13,28.07 25.66,28.07 26.19,28.08 26.72,28.08 27.25,28.08 27.78,28.08 28.31,28.08 28.84,28.08 29.37,28.08 29.9,28.08 30.43,28.08 30.96,28.08 21.95,28.07 22.48,28.07 21.51,49.66 21.53,50.19 21.57,50.72 21.62,51.25 21.68,51.78 21.77,52.31 21.86,52.83 21.97,53.35 22.1,53.87 22.24,54.39 22.4,54.91 22.57,55.42 22.75,55.93 22.96,56.43 23.18,56.93 23.4,57.41 23.64,57.89 23.9,58.37 24.18,58.84 24.46,59.3 24.75,59.75 25.06,60.19 25.38,60.63 25.71,61.05 26.06,61.46 26.41,61.86 26.78,62.26 27.16,62.64 27.55,63.02 27.95,63.38 28.37,63.73 28.79,64.08 29.22,64.41 29.67,64.73 30.13,65.05 30.59,65.34 31.07,65.62 31.56,65.88 32.04,66.14 32.53,66.38 33.04,66.59 33.54,66.8 34.05,67 34.57,67.18 35.09,67.32 35.6,67.48 36.12,67.61 36.64,67.73 37.16,67.83 37.69,67.92 38.22,67.99 38.76,68.04 39.29,68.09 39.83,68.11 40.38,68.12 40.53,30.09 40,30.1 39.47,30.12 38.94,30.16 38.41,30.21 37.88,30.27 37.35,30.36 36.83,30.45 36.31,30.56 35.79,30.69 35.27,30.83 34.75,30.99 34.24,31.16 33.73,31.34 33.23,31.55 32.73,31.77 32.25,31.99 31.77,32.23 31.29,32.49 30.82,32.77 30.36,33.05 29.91,33.34 29.47,33.65 29.03,33.97 28.61,34.3 28.2,34.65 27.8,35 27.4,35.37 27.02,35.75 26.64,36.14 26.28,36.54 25.93,36.96 25.58,37.38 25.25,37.81 24.93,38.26 24.61,38.72 24.32,39.18 24.04,39.66 23.78,40.15 23.52,40.63 23.28,41.12 23.07,41.63 22.86,42.13 22.66,42.64 22.48,43.16 22.34,43.68 22.18,44.19 22.05,44.71 21.93,45.23 21.83,45.75 21.74,46.28 21.67,46.81 21.62,47.35 21.57,47.88 21.55,48.42 21.54,48.97 59.4,48.55 59.38,48.02 59.34,47.49 59.29,46.96 59.23,46.43 59.14,45.9 59.05,45.38 58.94,44.86 58.81,44.34 58.67,43.82 58.51,43.3 58.34,42.79 58.16,42.28 57.95,41.78 57.73,41.28 57.51,40.8 57.27,40.32 57.01,39.84 56.73,39.37 56.45,38.91 56.16,38.46 55.85,38.02 55.53,37.58 55.2,37.16 54.85,36.75 54.5,36.35 54.13,35.95 53.75,35.57 53.36,35.19 52.96,34.83 52.54,34.48 52.12,34.13 51.69,33.8 51.24,33.48 50.78,33.16 50.32,32.87 49.84,32.59 49.35,32.33 48.87,32.07 48.38,31.83 47.87,31.62 47.37,31.41 46.86,31.21 46.34,31.03 45.82,30.89 45.31,30.73 44.79,30.6 44.27,30.48 43.75,30.38 43.22,30.29 42.69,30.22 42.15,30.17 41.62,30.12 41.08,30.1 40.53,30.09 40.38,68.12 40.91,68.11 41.44,68.09 41.97,68.05 42.5,68 43.03,67.94 43.56,67.85 44.08,67.76 44.6,67.65 45.12,67.52 45.64,67.38 46.16,67.22 46.67,67.05 47.18,66.87 47.68,66.66 48.18,66.44 48.66,66.22 49.14,65.98 49.62,65.72 50.09,65.44 50.55,65.16 51,64.87 51.44,64.56 51.88,64.24 52.3,63.91 52.71,63.56 53.11,63.21 53.51,62.84 53.89,62.46 54.27,62.07 54.63,61.67 54.98,61.25 55.33,60.83 55.66,60.4 55.98,59.95 56.3,59.49 56.59,59.03 56.87,58.55 57.13,58.06 57.39,57.58 57.63,57.09 57.84,56.58 58.05,56.08 58.25,55.57 58.43,55.05 58.57,54.53 58.73,54.02 58.86,53.5 58.98,52.98 59.08,52.46 59.17,51.93 59.24,51.4 59.29,50.86 59.34,50.33 59.36,49.79 59.37,49.24 103.51,0.29 103.51,0.82 103.51,1.35 103.51,1.88 103.51,2.41 103.5,2.94 103.5,3.47 103.5,4 103.5,4.53 103.5,5.06 103.5,5.59 103.5,6.12 103.5,6.65 103.5,7.18 103.5,7.71 103.49,8.24 103.49,8.77 103.49,9.3 103.49,9.83 103.49,10.36 103.49,10.89 103.49,11.42 103.49,11.95 103.49,12.48 103.48,13.01 103.48,13.54 103.48,14.07 103.48,14.6 103.48,15.13 103.48,15.66 103.48,16.19 103.48,16.72 103.48,17.25 103.48,17.78 103.47,18.31 103.47,18.84 103.47,19.37 103.47,19.9 103.47,20.43 103.47,20.96 103.47,21.49 103.47,22.02 103.47,22.55 103.46,23.08 103.46,23.61 103.46,24.14 103.46,24.67 103.46,25.2 103.46,25.73 103.46,26.26 103.46,26.79 103.46,27.32 103.46,27.85 141.52,0.29 141.52,0.82 141.52,1.35 141.52,1.88 141.52,2.41 141.51,2.94 141.51,3.47 141.51,4 141.51,4.53 141.51,5.06 141.51,5.59 141.51,6.12 141.51,6.65 141.51,7.18 141.51,7.71 141.5,8.24 141.5,8.77 141.5,9.3 141.5,9.83 141.5,10.36 141.5,10.89 141.5,11.42 141.5,11.95 141.5,12.48 141.49,13.01 141.49,13.54 141.49,14.07 141.49,14.6 141.49,15.13 141.49,15.66 141.49,16.19 141.49,16.72 141.49,17.25 141.49,17.78 141.48,18.31 141.48,18.84 141.48,19.37 141.48,19.9 141.48,20.43 141.48,20.96 141.48,21.49 141.48,22.02 141.48,22.55 141.47,23.08 141.47,23.61 141.47,24.14 141.47,24.67 141.47,25.2 141.47,25.73 141.47,26.26 141.47,26.79 141.47,27.32 141.47,27.85 141.05,28.17 140.52,28.17 139.99,28.17 139.46,28.17 138.93,28.17 138.4,28.16 137.87,28.16 137.34,28.16 136.81,28.16 136.28,28.16 135.75,28.16 135.22,28.16 134.69,28.16 134.16,28.16 133.63,28.16 133.1,28.15 132.57,28.15 132.04,28.15 131.51,28.15 130.98,28.15 130.45,28.15 129.92,28.15 129.39,28.15 128.86,28.15 128.33,28.14 127.8,28.14 127.27,28.14 126.74,28.14 126.21,28.14 125.68,28.14 125.15,28.14 124.62,28.14 124.09,28.14 123.56,28.14 123.03,28.13 122.5,28.13 121.97,28.13 121.44,28.13 120.91,28.13 120.38,28.13 119.85,28.13 119.32,28.13 118.79,28.13 118.26,28.12 117.73,28.12 117.2,28.12 116.67,28.12 116.14,28.12 115.61,28.12 115.08,28.12 114.55,28.12 114.02,28.12 113.49,28.12 105.01,28.11 105.54,28.11 106.07,28.11 106.6,28.11 107.13,28.11 107.66,28.11 108.19,28.12 108.72,28.12 109.25,28.12 109.78,28.12 110.31,28.12 110.84,28.12 111.37,28.12 111.9,28.12 112.43,28.12 112.96,28.12 103.95,28.11 104.48,28.11 103.51,49.7 103.53,50.23 103.57,50.76 103.62,51.29 103.68,51.82 103.77,52.35 103.86,52.87 103.97,53.39 104.1,53.91 104.24,54.43 104.4,54.95 104.57,55.46 104.75,55.97 104.96,56.47 105.18,56.97 105.4,57.45 105.64,57.93 105.9,58.41 106.18,58.88 106.46,59.34 106.75,59.79 107.06,60.23 107.38,60.67 107.71,61.09 108.06,61.5 108.41,61.9 108.78,62.3 109.16,62.68 109.55,63.06 109.95,63.42 110.37,63.77 110.79,64.12 111.22,64.45 111.67,64.77 112.13,65.09 112.59,65.38 113.07,65.66 113.56,65.92 114.04,66.18 114.53,66.42 115.04,66.63 115.54,66.84 116.05,67.04 116.57,67.22 117.09,67.36 117.6,67.52 118.12,67.65 118.64,67.77 119.16,67.87 119.69,67.96 120.22,68.03 120.76,68.08 121.29,68.13 121.83,68.15 122.38,68.16 122.53,30.13 122,30.14 121.47,30.16 120.94,30.2 120.41,30.25 119.88,30.31 119.35,30.4 118.83,30.49 118.31,30.6 117.79,30.73 117.27,30.87 116.75,31.03 116.24,31.2 115.73,31.38 115.23,31.59 114.73,31.81 114.25,32.03 113.77,32.27 113.29,32.53 112.82,32.81 112.36,33.09 111.91,33.38 111.47,33.69 111.03,34.01 110.61,34.34 110.2,34.69 109.8,35.04 109.4,35.41 109.02,35.79 108.64,36.18 108.28,36.58 107.93,37 107.58,37.42 107.25,37.85 106.93,38.3 106.61,38.76 106.32,39.22 106.04,39.7 105.78,40.19 105.52,40.67 105.28,41.16 105.07,41.67 104.86,42.17 104.66,42.68 104.48,43.2 104.34,43.72 104.18,44.23 104.05,44.75 103.93,45.27 103.83,45.79 103.74,46.32 103.67,46.85 103.62,47.39 103.57,47.92 103.55,48.46 103.54,49.01 141.4,48.59 141.38,48.06 141.34,47.53 141.29,47 141.23,46.47 141.14,45.94 141.05,45.42 140.94,44.9 140.81,44.38 140.67,43.86 140.51,43.34 140.34,42.83 140.16,42.32 139.95,41.82 139.73,41.32 139.51,40.84 139.27,40.36 139.01,39.88 138.73,39.41 138.45,38.95 138.16,38.5 137.85,38.06 137.53,37.62 137.2,37.2 136.85,36.79 136.5,36.39 136.13,35.99 135.75,35.61 135.36,35.23 134.96,34.87 134.54,34.52 134.12,34.17 133.69,33.84 133.24,33.52 132.78,33.2 132.32,32.91 131.84,32.63 131.35,32.37 130.87,32.11 130.38,31.87 129.87,31.66 129.37,31.45 128.86,31.25 128.34,31.07 127.82,30.93 127.31,30.77 126.79,30.64 126.27,30.52 125.75,30.42 125.22,30.33 124.69,30.26 124.15,30.21 123.62,30.16 123.08,30.14 122.53,30.13 122.38,68.16 122.91,68.15 123.44,68.13 123.97,68.09 124.5,68.04 125.03,67.98 125.56,67.89 126.08,67.8 126.6,67.69 127.12,67.56 127.64,67.42 128.16,67.26 128.67,67.09 129.18,66.91 129.68,66.7 130.18,66.48 130.66,66.26 131.14,66.02 131.62,65.76 132.09,65.48 132.55,65.2 133,64.91 133.44,64.6 133.88,64.28 134.3,63.95 134.71,63.6 135.11,63.25 135.51,62.88 135.89,62.5 136.27,62.11 136.63,61.71 136.98,61.29 137.33,60.87 137.66,60.44 137.98,59.99 138.3,59.53 138.59,59.07 138.87,58.59 139.13,58.1 139.39,57.62 139.63,57.13 139.84,56.62 140.05,56.12 140.25,55.61 140.43,55.09 140.57,54.57 140.73,54.06 140.86,53.54 140.98,53.02 141.08,52.5 141.17,51.97 141.24,51.44 141.29,50.9 141.34,50.37 141.36,49.83 141.37,49.28 71.35,64.29 71.88,64.29 72.41,64.29 72.94,64.29 73.47,64.29 74,64.29 74.53,64.3 75.06,64.3 75.59,64.3 76.12,64.3 76.65,64.3 77.18,64.3 77.71,64.3 78.24,64.3 78.77,64.3 79.3,64.3 82.48,64.3 81.95,64.3 81.42,64.3 80.89,64.3 80.36,64.3 79.83,64.3 69.33,73.04 69.33,72.51 69.33,71.98 69.33,71.45 69.33,70.92 69.33,70.39 69.33,69.86 69.32,69.33 69.32,68.8 69.32,68.27 69.32,67.74 69.32,67.21 69.32,66.68 69.32,66.15 69.32,65.62 69.32,65.09 69.32,64.56 70.82,64.31 71.35,64.31 71.88,64.31 72.41,64.31 72.94,64.31 73.47,64.31 74,64.3 74.53,64.3 75.06,64.3 75.59,64.3 76.12,64.3 76.65,64.3 77.18,64.3 69.76,64.31 70.29,64.31 69.33,74.63 69.33,74.1 69.33,73.57 69.33,73.04 91.62,64.3 91.09,64.3 90.56,64.3 90.03,64.3 89.5,64.3 88.97,64.3 88.44,64.31 87.91,64.31 87.38,64.31 86.85,64.31 86.32,64.31 85.79,64.31 85.26,64.31 84.73,64.31 84.2,64.31 83.67,64.31 82.61,64.31 83.14,64.31 93.64,73.05 93.64,72.52 93.64,71.99 93.64,71.46 93.64,70.93 93.64,70.4 93.64,69.87 93.65,69.34 93.65,68.81 93.65,68.28 93.65,67.75 93.65,67.22 93.65,66.69 93.65,66.16 93.65,65.63 93.65,65.1 93.65,64.57 92.15,64.32 91.62,64.32 91.09,64.32 90.56,64.32 90.03,64.32 89.5,64.32 88.97,64.31 88.44,64.31 87.91,64.31 87.38,64.31 86.85,64.31 86.32,64.31 85.79,64.31 93.21,64.32 92.68,64.32 93.64,74.64 93.64,74.11 93.64,73.58 93.64,73.05
Milling: area 9.5,57 to 14.5,62; area 91.5,58.5 to 96.5,63.5; 13 lines

### Footprints (pad centres in the part's own frame; a part is rotated, then mirrored left to right if it is on the bottom)
JST_B2B-PH_HEADER = drill 0.8 long: P1 1.075,0.048; P2 -0.925,0.048
C0603 = smd 1.1 x 1: 1 -0.85,0; 2 0.85,0
C0603K = smd 1.05 x 1.08: 1 -0.875,0; 2 0.875,0
SMC_C = smd 2.4 x 2.4: + -2.5,0; - 2.5,0
0402-CAP = smd 0.7 x 0.9: 1 -0.65,0; 2 0.65,0
0603 = smd 1.1 x 1: 1 -0.85,0; 2 0.85,0
MINIMELF = smd 1.4 x 1.8: A 1.7,0; C -1.7,0
SMA = smd 2 x 2: P$1 -1.94,0; P$2 1.94,0
L1812 = smd 1.9 x 3.4: 1 -1.95,0; 2 1.95,0
SOT223 = smd 1.219 x 2.235: 1 -2.311,-3.099; 2 0,-3.099; 3 2.311,-3.099 | smd 3.6 x 2.2: 4 0,3.099
POWER-SO20 = smd 0.635 x 1.778: P$1 -5.715,-6.782; P$2 -4.445,-6.782; P$3 -3.175,-6.782; P$4 -1.905,-6.782; P$5 -0.635,-6.782; P$6 0.635,-6.782; P$7 1.905,-6.782; P$8 3.175,-6.782; P$9 4.445,-6.782; P$10 5.715,-6.782; P$11 5.715,6.782; P$12 4.445,6.782; P$13 3.175,6.782; P$14 1.905,6.782; P$15 0.635,6.782; P$17 -1.905,6.782; P$18 -3.175,6.782; P$19 -4.445,6.782; P$20 -5.715,6.782 | smd 0.635 x 1.651: P$16 -0.635,6.833 | smd 9.804 x 6.198: P$21 0,0 | smd 3.048 x 2.921: P$22 -6.426,0; P$23 6.426,0
TSM-103-XX-XXX-DV-A = smd 1.27 x 3.683: 1 -2.54,-2.477; 2 -2.54,2.477; 3 0,-2.477; 4 0,2.477; 5 2.54,-2.477; 6 2.54,2.477
USB-B-PTH-VERTICAL = drill 0.914 pad 1.676: D+ 4.826,4.394; D- 4.826,7.595; GND 7.315,4.394; VBUS 7.315,7.595 | drill 2.286: P$1 0,4.902; P$2 12.04,4.902
1X10 = drill 1.016 long: 1 -11.43,0; 2 -8.89,0; 3 -6.35,0; 4 -3.81,0; 5 -1.27,0; 6 1.27,0; 7 3.81,0; 8 6.35,0; 9 8.89,0; 10 11.43,0
LED5MM = drill 0.813 octagon: A -1.27,0; K 1.27,0
0805 = smd 1.2 x 1: 1 -1.1,0; 2 1.1,0
SOP16 = smd 0.6 x 2.2: 1 -4.455,-3.6; 2 -3.185,-3.6; 3 -1.915,-3.6; 4 -0.645,-3.6; 5 0.625,-3.6; 6 1.895,-3.6; 7 3.165,-3.6; 8 4.435,-3.6; 9 4.435,3.6; 10 3.165,3.6; 11 1.895,3.6; 12 0.625,3.6; 13 -0.645,3.6; 14 -1.915,3.6; 15 -3.185,3.6; 16 -4.455,3.6
PANASONIC_D = smd 3 x 1.4: + 2.4,0; - -2.4,0
1X02 = drill 1.016 long: 1 -1.27,0; 2 1.27,0
1X04 = drill 1.016 long: 1 -3.81,0; 2 -1.27,0; 3 1.27,0; 4 3.81,0
SOT23 = smd 1.016 x 1.143: 1 -0.889,-1.016; 2 0.889,-1.016; 3 0,1.016
R0603 = smd 1 x 1.1: 1 -0.85,0; 2 0.85,0
R0603' = smd 0.889 x 0.889: 1 -0.762,0; 2 0.762,0
R0603-ROUND = smd 0.898 x 1.1: 1 -0.889,0; 2 0.889,0
CHIPLED_0603 = smd 0.8 x 0.8: A 0,-0.75; C 0,0.75
TQFP44-PAD = smd 1.4 x 0.45: 1 -5.8,4; 2 -5.8,3.2; 3 -5.8,2.4; 4 -5.8,1.6; 5 -5.8,0.8; 6 -5.8,0; 7 -5.8,-0.8; 8 -5.8,-1.6; 9 -5.8,-2.4; 10 -5.8,-3.2; 11 -5.8,-4; 23 5.8,-4; 24 5.8,-3.2; 25 5.8,-2.4; 26 5.8,-1.6; 27 5.8,-0.8; 28 5.8,0; 29 5.8,0.8; 30 5.8,1.6; 31 5.8,2.4; 32 5.8,3.2; 33 5.8,4 | smd 0.45 x 1.4: 12 -4,-5.8; 13 -3.2,-5.8; 14 -2.4,-5.8; 15 -1.6,-5.8; 16 -0.8,-5.8; 17 0,-5.8; 18 0.8,-5.8; 19 1.6,-5.8; 20 2.4,-5.8; 21 3.2,-5.8; 22 4,-5.8; 34 4,5.8; 35 3.2,5.8; 36 2.4,5.8; 37 1.6,5.8; 38 0.8,5.8; 39 0,5.8; 40 -0.8,5.8; 41 -1.6,5.8; 42 -2.4,5.8; 43 -3.2,5.8; 44 -4,5.8 | smd 1 x 1: P$1 0,0
SO16 = smd 0.66 x 2.032: 1 -4.445,-3.073; 2 -3.175,-3.073; 3 -1.905,-3.073; 4 -0.635,-3.073; 5 0.635,-3.073; 6 1.905,-3.073; 7 3.175,-3.073; 8 4.445,-3.073; 9 4.445,3.073; 10 3.175,3.073; 11 1.905,3.073; 12 0.635,3.073; 13 -0.635,3.073; 14 -1.905,3.073; 15 -3.175,3.073; 16 -4.445,3.073
CRYSTAL-3.2-2.5 = smd 1.3 x 1.05: 1 -1.15,-0.925; 2 1.15,-0.925; 3 1.15,0.925; 4 -1.15,0.925
CT/CN0603 = smd 1 x 1: 1 -1,0; 2 1,0

### Placement (x,y rotation side)
12-PWR-1  152.04,21.05 180 top
C1  150.05,16.66 0 top
C2  160.42,7.35 0 top
C3  81.31,59.8 270 top
C4  85.32,59.81 270 top
C5  71.25,50.04 90 top
C6  76.74,59.81 270 top
C7  73.57,59.74 90 bottom
C9  99.32,2.58 90 top
C12  75.97,38.2 270 top
C13  83.37,38.25 90 top
C14  84.48,4.21 90 top
C15  82.7,40.38 180 bottom
C16  87.14,40.38 0 bottom
CAT  97.23,2.62 90 top
D2  69.23,51.12 90 top
D9  66.57,24.51 270 bottom
D10  71.82,24.5 270 bottom
D11  94.6,32.51 90 bottom
D12  98.15,32.58 90 bottom
D13  97.95,25.6 90 bottom
D14  66.49,32.68 270 bottom
D15  71.7,32.65 270 bottom
D16  94.69,25.44 90 bottom
F2  77.31,3.93 270 top
IC1  158.98,13.67 0 top
IC2  148.93,4.07 90 top
IC3  82.97,30.44 90 bottom
ICSP  67.1,7.58 180 top
JP1  77.19,8.56 0 top
JP2  160.14,37.4 90 top
JP3  4.9,37.4 90 top
L1  12,59.49 270 bottom
L2  93.62,60.75 0 bottom
L3  67.68,57.75 90 bottom
M1  59.41,32.05 270 top
M2  103.25,33.12 270 top
MOT-PWR-1  158.29,21.08 180 top
OC1  79.81,51.22 90 bottom
OC3  83.93,27.86 270 top
PC2  150.54,11.77 0 top
PD1  63.78,17.45 270 top
PD2  145.78,17.45 270 top
PS1  17.17,17.49 90 top
PS2  99.17,17.49 90 top
Q1  97.22,70.4 90 top
Q3  13.83,70.5 90 top
R1  95.35,2.62 270 top
R2  99.16,24.91 180 top
R3  1k  [R0603']  9.43,68.36 0 top
R4  15R  [R0603']  97.48,73.09 0 top
R5  157.45,52.54 180 top
R6  141.77,72.66 0 top
R7  141.83,69.93 180 bottom
R8  157.47,60.9 180 top
R9  141.8,67.3 180 bottom
R10  3.9k  [R0603']  102.59,69.51 180 top
R11  1k  [R0603']  101.82,72.31 270 top
R12  69.93,38.99 0 top
R13  101.45,2.58 270 top
R14  157.47,58.92 180 top
R15  157.45,55.42 180 top
R16  157.45,53.96 180 top
R17  14.18,27.36 180 top
R18  19.39,34.04 180 top
R19  19.39,35.57 180 top
R20  19.39,37.13 180 top
R21  19.39,38.64 180 top
R22  19.39,40.14 180 top
R23  19.39,41.67 180 top
R24  13.88,66.73 180 top
R25  96.71,66.29 90 bottom
R26  19.39,43.19 180 top
R87  15R  [R0603']  9.42,70.51 180 top
R93  3.9k  [R0603']  17.49,69.63 180 top
RA1  67.08,41.76 90 top
RA2  149.57,41.76 90 top
RC1  68.73,46.8 0 bottom
RC2  68.49,49.31 0 bottom
RC3  68.49,51.91 0 bottom
RC4  68.53,54.39 0 bottom
RC5  76.39,29.89 180 top
RC6  76.39,28.39 180 top
RC7  9.89,45.73 0 top
RC8  157.41,65.02 0 top
RC9  76.39,32.81 180 top
RC10  76.39,31.39 180 top
RF1  63.33,41.76 270 top
RF2  145.33,41.76 270 top
RHWB  88.2,58.08 90 top
RM1  98.81,43.61 180 top
RM2  98.8,46.04 180 top
RM3  98.78,48.46 180 top
RM4  98.76,50.87 180 top
RM9  76.41,26.96 180 top
RM10  76.4,25.08 0 top
RM11  76.46,23.22 180 top
RM12  76.58,21.71 0 top
RP3A  94.44,6.32 90 top
RP3B  69.13,15.59 90 top
RSCL1  95.25,15.48 270 top
RSCL2  91.36,40.24 90 bottom
RSCL3  93.71,15.46 270 top
RSDA2  86.25,38.23 90 top
RSENA1  76.35,22.42 270 bottom
RSENB1  91.17,21.52 0 bottom
TX1  95.25,12.68 180 top
TX2  93.7,12.63 180 top
U1  79.92,48.8 0 top
U4  12.25,38.51 90 top
U5  149.25,68.17 270 top
Y3  79.76,38.16 0 top
Z1  97.22,6.22 270 top
Z2  99.29,6.19 270 top

### Tracks (layer width: path | path; a pad name or v marks a point on that pad's centre or on a via)
5VMOT  (via drill 0.25 pad 0.25)  (3 unrouted)
  Top 0.406: PC2.+ 152.94,11.69 153.99,10.64 153.99,5.01 153.13,4.15 152.11,4.15 IC2.2 IC2.4 145.78,4.12 v143.64,4.12 | RM4.1 99.63,50.85 RM3.1 99.65,48.44 RM2.1 99.66,46.03 RM1.1 v99.66,42.14
  Bottom 0.305: 113.21,28.78 141.51,28.84 142.27,28.11 142.27,5.49
  Bottom 0.406: 113.21,28.78 v99.66,42.14 | v143.64,4.12 142.27,5.49 | C15.2 C16.2 86.49,36.93 88.52,34.91 89.73,34.91 IC3.P$12
12PWR+  (via drill 0.25 pad 0.25)  (1 unrouted)
  Top 0.406: JP2.4 156.26,33.59 v156.24,33.57 | C2.2 161.29,7.37 IC1.3 v161.29,13.18 v161.28,13.19 | 12-PWR-1.P1 150.96,23.84 v150.95,24.35
  Bottom 0.406: v156.24,33.57 150.98,28.31 v150.95,24.35 159.58,24.3 160.68,24.3 162.23,22.75 162.23,14.14 v161.28,13.19
+5V  (via drill 0.25 pad 0.25)  (12 unrouted)
  Top 0.305: 144.47,16.18 142.38,17.29 142.49,27.96 141.54,28.84 102.99,28.78 102.02,27.67 102.06,19.72 101.13,18.76 | 60.56,27.84 60.56,18.31 62.82,16.05
  Top 0.406: U1.34 83.94,54.62 v83.94,57.73 | C3.1 v83.92,60.67 83.94,60.69 C4.1 85.34,60.67 v86.76,60.67 88.46,60.67 91.25,57.88 95.64,57.88 99.56,61.8 99.56,65.36 v99.55,67.16 | R11.1 100.96,73.09 v99.54,73.09 R4.2 | U5.16 159.66,72.61 161.58,70.69 161.58,65.07 v161.63,65.02 | v159.59,65.02 RC8.2 | 145.35,40.51 RF2.3 145.75,40.49 v147.9,38.27 147.9,16.2 147.92,16.18 | IC1.2 IC1.4 157.09,16.77 v156.53,16.2 | 147.92,16.18 PD2.2 144.47,16.18 | 147.92,16.18 v147.94,16.2 | U4.16 v10.85,34.06 v10.86,34.06 | v12.09,18.73 12.12,18.76 PS1.3 18.84,18.76 20.73,20.65 20.73,28.1 21.4,28.77 59.63,28.77 60.56,27.84 | v10.84,43.51 10.84,44.79 RC7.2 10.74,56.08 | 74.01,51.89 U1.2 72.79,52 72.05,52.74 72.05,58.21 72.54,58.7 74.69,58.7 75.63,57.76 v75.63,57.68 | R12.1 64.83,38.99 RF1.3 61.86,40.49 60.21,41.58 60.21,48.48 | R87.2 8.66,70.45 R3.1 8.59,68.28 8.59,65.93 | R24.2 9.65,66.73 8.85,65.93 8.59,65.93 | 10.74,56.08 10.74,56.32 | 10.74,56.08 8.59,58.23 8.59,65.93 | 99.21,18.8 PS2.3 101.13,18.76 | R13.2 99.33,1.69 C9.1 97.29,1.71 | 97.29,1.71 CAT.1 | v80.12,0.82 78.47,0.82 F2.2 71.15,1.98 ICSP.2 71.86,7.32 v71.86,9.91 | 97.29,1.71 96.41,0.82 v96.27,0.82 | 62.82,16.05 63.65,16.05 PD1.2 | D2.C 70.65,48 U1.7
  Bottom 0.406: v83.92,60.67 83.92,57.75 v83.94,57.73 83.89,57.68 v75.63,57.68 | v159.59,65.02 v161.63,65.02 161.63,53.1 153.38,44.85 153.38,44.8 151.88,43.3 151.88,39.82 150.34,38.28 v147.9,38.27 | v147.94,16.2 v156.53,16.2 156.56,16.23 | v12.09,18.73 10.86,19.96 v10.86,34.06 10.86,43.49 v10.84,43.51 | RC3.2 67.64,54.35 RC4.2 L3.1 | RC3.2 | RC3.2 RC2.2 67.88,49.07 RC1.2 | v99.54,73.09 99.56,67.37 v99.55,67.16 v99.54,67.17 R25.2 | v80.12,0.82 v96.27,0.82 | PD1.2 65.59,16.18 v71.86,9.91
AREF  (1 unrouted)
AVCC  (via drill 0.25 pad 0.25)
  Top 0.406: U1.44 73.54,56.98 v73.54,57.5 | U1.24 89.07,45.6 98.79,55.32 | 98.79,55.32 98.84,55.32 | 98.79,55.32 v98.69,55.32
  Bottom 0.406: L3.2 73.55,58.85 C7.1 73.57,57.53 v73.54,57.5 73.59,57.45 74.16,57.45 74.88,56.74 85.96,56.74 87.31,55.38 98.63,55.38 v98.69,55.32
D+  (via drill 0.25 pad 0.25)
  Top 0.406: JP1.D+ 82.06,12.91 v82.06,11.01 | v91.99,7.14 94.41,7.14 RP3A.2 94.39,7.22 v94.39,8.47 | Z1.1 97.15,7.29 v97.15,8.49
  Bottom 0.406: v82.06,11.01 85.93,7.14 v91.99,7.14 | v94.39,8.47 94.41,8.49 v97.15,8.49
D-  (via drill 0.25 pad 0.25)
  Top 0.406: RP3B.2 69.41,16.16 JP1.D- | Z2.1 99.21,7.27 v99.21,9.78
  Bottom 0.406: v99.21,9.78 93.37,9.78 91.87,11.28 91.87,16.4 89.93,18.34 84.2,18.34 JP1.D-
GND  (via drill 0.25 pad 0.25, 0.6 pad 0.25)  (6 unrouted)
  Top 0.406: v75.24,59.74 76.05,58.93 C6.2 | C6.2 C3.2 81.32,58.92 82.61,58.92 | 82.61,58.92 C4.2 84.85,58.93 RHWB.2 | U1.35 83.12,58.41 82.61,58.92 | RHWB.2 88.19,59.31 | 88.25,58.88 RHWB.2 | 146.15,63.74 U5.8 | U5.8 148.14,63.72 148.97,64.55 148.97,68.25 149.49,68.77 152.29,68.77 U5.13 | U5.8 146.16,49.57 146.16,49.13 146.48,48.81 147.87,47.47 154.32,41.02 154.32,39.32 | 146.06,42.92 145.44,42.92 RF2.2 146.56,41.8 148.84,41.8 148.89,41.75 151.89,41.75 154.32,39.32 | 154.32,39.32 154.32,32.36 155.59,31.09 159.58,31.09 | 159.58,31.09 160.1,31.09 JP2.3 | 12-PWR-1.P2 v152.96,23.5 152.96,24.48 159.58,31.09 | C2.1 158.97,7.35 156.67,9.65 IC1.1 156.64,10.6 v156.64,12.99 | PS1.2 17.12,16.17 11.78,16.17 2.62,25.33 2.62,29.48 4.19,31.05 JP3.3 v7.23,31.05 | 14.83,42.95 U4.8 | 9.8,37.88 U4.13 | 9.8,37.88 12.54,37.88 13.33,38.66 13.33,42.19 14.09,42.95 14.83,42.95 | Q3.2 16.09,71.39 v16.1,71.4 17.1,72.4 56.4,72.4 61.21,67.63 v61.24,55.73 | 14.83,42.95 16.1,44.23 v16.1,44.3 v16.1,68.33 | C6.2 76.74,54.63 U1.43 76.72,52 79.12,49.6 | 79.12,49.6 U1.5 72.56,49.6 C5.2 | 79.12,49.6 U1.P$1 78.34,47.22 v78.34,44.73 | U1.23 84.53,44.8 84.46,44.73 v78.34,44.73 | RHWB.2 88.23,58.97 88.83,58.97 90.82,56.98 96.47,56.98 100.62,61.13 100.58,67.99 | Q1.2 100.52,71.28 v100.55,71.26 | v7.23,37.84 9.76,37.84 9.8,37.88 | U5.8 142.98,63.72 134.16,72.54 111.57,72.54 107.03,68 100.69,68 v100.59,68.01 | C12.1 Y3.4 78.32,39.38 U1.15 | Y3.2 83.23,37.23 C13.1 | R13.1 99.33,3.47 C9.2 | C9.2 99.32,5.16 Z2.2 97.25,5.19 Z1.2 95.93,6.51 95.93,11.19 95.25,11.87 TX1.C | C9.2 99.3,3.47 CAT.2 R1.1 | JP1.GND 84.48,12.93 C14.- 83.23,7.96 v82.11,7.96
  Top 0.406: TX1.C 95.2,11.88 TX2.C 93.56,11.88 92.69,11.01 86.45,11.01 JP1.GND | OC3.9 87.53,15.98 JP1.GND | ICSP.6 64.56,2.39 v64.49,2.32 | v73.51,7.91 v77.85,7.91 | 78.37,43.05 U1.15 | v78.34,44.73 78.34,43.02 U1.15 | RF1.2 62.49,43.03 v61.23,44.29 | TX1.C 95.43,11.93 96.49,12.99 96.49,14.48 98.25,16.24 99.15,16.24 PS2.2
  Bottom 0.406: C7.2 74.36,60.62 v75.24,59.74 | v152.96,23.5 159.84,23.5 161.41,21.93 161.41,17.79 156.69,13.07 156.69,13.04 v156.64,12.99 | v16.1,44.3 16.1,44.26 | v100.59,68.01 100.51,71.22 v100.55,71.26 | v16.1,71.4 v16.1,68.33 | v7.23,31.05 v7.23,37.84 | v77.85,7.91 77.9,7.96 v82.11,7.96 | v78.34,44.73 78.32,44.75 75.94,42.54 71.06,42.54 68.83,44.29 v61.23,44.29 61.2,55.81 | v64.49,2.32 69.85,2.32 73.51,5.98 v73.51,7.91
GNDMOT  (via drill 0.25 pad 0.25)  (5 unrouted)
  Top 0.406: JP2.1 159.21,25.05 MOT-PWR-1.P2 159.2,21.02 v159.2,18.74 | IC2.1 148.73,1.76 v147.8,2.69 | v147.8,7.91 147.8,11.37 147.77,11.4 PC2.- 149.2,12.83 C1.1 149.2,18.74 v149.21,18.75 | v144.32,24.92 144.42,25.02 v144.42,29.3 | JP3.1 4.9,25.89 7.27,23.52 16.1,23.52 v16.15,23.57 | RM10.2 77.25,21.89 RM12.2
  Bottom 0.305: 65.81,22.57 59.64,28.74 21.36,28.74 16.17,23.55
  Bottom 0.406: v147.8,2.69 v147.8,7.91 | v159.2,18.74 v159.19,18.75 v149.21,18.75 144.32,23.64 v144.32,24.92 | 83.43,55.64 OC1.9 82.19,55.66 81.42,54.89 81.42,54 | 81.41,51.42 81.41,48.97 82.37,48.01 83.39,48.01 OC1.15 | 81.41,51.42 81.41,52.11 81.42,52.12 81.42,54 | 81.41,51.42 82.25,50.58 OC1.13 | OC1.11 82.3,53.12 81.42,54 | v144.42,29.3 142.23,31.49 142.23,57.64 130.64,69.23 114.36,69.23 98.15,53.02 D12.P$2 94.67,34.52 D11.P$2 92.89,36.16 IC3.P$11 89.75,38.42 C16.1 | RSENB1.2 89.75,22.09 IC3.P$20 83.68,24.73 IC3.P$22 78.79,24.01 | IC3.P$10 82.26,36.16 IC3.P$23 82.05,37.79 C15.1 | 65.81,22.57 D9.P$2 71.8,22.57 D10.P$2 72.81,21.57 RSENA1.2 78.79,24.01 | 16.17,23.55 v16.15,23.57 | IC3.P$1 78.08,24.73 78.79,24.01
HWB
  Top 0.406: U1.33 88.19,55.28 RHWB.1
IN11  (via drill 0.25 pad 0.25)  (1 unrouted)
  Top 0.406: RM1.2 96.1,43.61 v96.07,43.58
  Bottom 0.406: v96.07,43.58 92.88,46.77 OC1.16
IN11#  (1 unrouted)
IN12  (via drill 0.25 pad 0.25)  (1 unrouted)
  Top 0.406: v96.04,45.91 97.82,45.91 RM2.2
  Bottom 0.406: OC1.14 92.64,49.31 v96.04,45.91
IN12#  (via drill 0.25)
  Top 0.406: U1.37 81.52,53.17 v79.33,50.58
  Bottom 0.406: v79.33,50.58 76.24,50.55 OC1.4
IN21  (via drill 0.25 pad 0.25)  (1 unrouted)
  Top 0.406: v95.96,48.42 97.89,48.42 RM3.2
  Bottom 0.406: OC1.12 92.5,51.85 96.04,48.31 96.04,48.34 v95.96,48.42
IN21#  (via drill 0.25 pad 0.25)
  Top 0.406: v79.72,53.08 79.88,53.08 80.71,53.91 U1.38
  Bottom 0.406: v79.72,53.08 OC1.6
IN22  (via drill 0.25 pad 0.25)  (1 unrouted)
  Top 0.406: v96.04,50.89 97.89,50.89 RM4.2
  Bottom 0.406: OC1.10 92.39,54.39 95.96,50.82 95.97,50.82 v96.04,50.89
IN22#  (via drill 0.25 pad 0.25)
  Top 0.406: U1.39 79.88,54.64 v79.87,55.9
  Bottom 0.406: OC1.8 76.46,55.9 v79.87,55.9
LC1  (via drill 0.25 pad 0.25)
  Top 0.406: R87.1 v11.55,70.51 12.8,70.51 Q3.3 | v11.54,65.49 10.67,64.62 10.67,59.55 L1.K 14.19,56.03 v14.19,44.43 | PS1.1 v14.2,13.68 v14.19,13.67
  Bottom 0.406: v11.54,65.49 v11.55,70.51 | v14.19,13.67 v14.19,44.43
LC1#  (via drill 0.25 pad 0.25)  (1 unrouted)
  Top 0.406: OC3.12 86.1,27.23 86.1,27.24 85.32,27.24 83.62,28.94 83.62,32.25 82.82,33.05 | v72.95,36.42 72.95,36.37 75.01,34.61 81.26,34.61 82.82,33.05 | v60.28,55.03 60.28,65.89 55.31,71.46 19.65,71.46 19.36,71.17 19.14,71.17 18.32,70.35 18.32,69.69 R93.1 | 82.82,33.05 82.42,33.45
  Bottom 0.406: v72.95,36.42 61.86,36.37 60.22,37.65 60.23,54.78
LC1_UC  (1 unrouted)
LC2  (via drill 0.25 pad 0.25)  (1 unrouted)
  Top 0.406: v94.95,70.39 v94.95,70.4 Q1.3 | v95.02,73.03 95.08,73.09 R4.1
  Bottom 0.406: v95.02,73.03 94.95,72.96 v94.95,70.39 94.95,63.35 L2.K
LC2#  (1 unrouted)
LC2_UC  (1 unrouted)
M1-A  (via drill 0.25 pad 0.25)
  Top 0.406: v69.87,28.47 69.93,28.53 v73.02,28.53
  Bottom 0.406: D14.P$2 66.49,26.53 D9.P$1 | M1.P1 66.25,30.98 D14.P$2 | D14.P$2 68.75,28.47 v69.87,28.47 | v73.02,28.53 v73.02,28.54 IC3.P$4
M1-B
  Bottom 0.406: D15.P$2 71.7,26.56 D10.P$1 | D15.P$2 72.6,29.8 IC3.P$5 | M1.P2 59.9,32.53 69.77,32.53 71.59,30.71 D15.P$2
M2-A
  Bottom 0.406: D11.P$1 94.59,30.93 D16.P$2 | M2.P1 102.96,32.38 96.07,32.38 94.6,30.91 D11.P$1 | IC3.P$16 93.83,29.8 D11.P$1
M2-B  (via drill 0.25 pad 0.25)
  Top 0.406: M2.P2 102.07,34.04 100.59,32.56 100.59,30.74 v100.56,30.71
  Bottom 0.406: 90.25,28.54 IC3.P$17 89.86,28.43 91.2,28.43 92.18,27.45 92.18,26.31 93.01,25.48 93.83,25.48 | 93.83,25.48 93.31,25.48 | 93.83,25.48 96.2,25.48 D13.P$2 98.15,27.44 D12.P$1 100.49,30.64 v100.56,30.71
MISO  (via drill 0.25 pad 0.25)  (2 unrouted)
  Top 0.406: JP3.10 5.45,48.83 v8.66,52.04 | v19.25,52.07 v19.26,52.08 19.26,65.65 22.51,68.9 52.59,68.9 v59.27,62.22 | U1.11 66.86,44.8 63.65,48.01 63.65,60.99 62.5,62.14 62.5,62.16 v62.46,62.2
  Bottom 0.406: v8.66,52.04 8.69,52.07 v19.25,52.07 | v62.46,62.2 59.29,62.2 v59.27,62.22
MOSI  (via drill 0.25 pad 0.25)  (1 unrouted)
  Top 0.406: JP3.9 5.21,46.29 v8.84,49.92 | v72.15,44.05 72.12,38.47 68.91,35.26 68.91,18.29 62.76,12.14 62.85,2.2 63.64,1.16 66.23,1.16 67.3,2.23 67.3,4.9 ICSP.4 | v18.27,50.65 v18.28,50.66 18.28,66.1 21.89,69.71 53.33,69.71 v59.12,63.92 | U1.10 v72.18,45.6 67.12,45.6 64.44,48.28 64.44,61.68 v62.61,63.51
  Bottom 0.406: v8.84,49.92 9.57,50.65 v18.27,50.65 | v62.61,63.51 59.53,63.51 v59.12,63.92 | v72.15,44.05 72.16,45.58 v72.18,45.6
N$1
  Bottom 0.406: RC2.1 OC1.3
N$2
  Bottom 0.406: RC3.1 69.4,51.85 OC1.5
N$3  (1 unrouted)
N$4
  Bottom 0.406: RC4.1 OC1.7
N$5
  Top 0.406: RC8.1 152.35,65.02 U5.10
N$6  (1 unrouted)
N$7
  Top 0.406: Q1.1 R10.2 R11.2
N$8  (via drill 0.25 pad 0.25)
  Top 0.406: U4.10 10.44,41.69 v13.19,44.43 | RC7.1 v9.04,44.48
  Bottom 0.406: v13.19,44.43 9.04,44.43 v9.04,44.48
N$9
  Top 0.406: RC9.1 78.5,32.81 79.02,32.29 80.3,32.29 OC3.1
N$10  (1 unrouted)
N$11  (1 unrouted)
N$12
  Top 0.406: U5.15 159.47,71.34 160.44,70.37 160.44,51.4 159.93,50.89 157.32,50.89 157.31,50.88 156.62,51.57 156.62,52.52 R5.2
N$13
  Top 0.406: R24.1 14.73,63.94 L1.A
N$14
  Top 0.406: U5.1 142.67,72.61 R6.2
N$15  (via drill 0.25 pad 0.25)
  Top 0.406: v144.36,71.35 U5.2
  Bottom 0.406: R7.2 144.32,71.31 v144.36,71.35
N$16  (via drill 0.25 pad 0.25)
  Top 0.406: R8.2 v156.62,62.05 v156.63,62.06 | U5.3 147.89,70.07 v147.91,70.09
  Bottom 0.406: v147.91,70.09 148.17,70.09 v156.63,62.06
N$17  (via drill 0.25 pad 0.25)
  Top 0.406: U5.7 146.19,64.97 v147.79,64.97 | 156.51,53.86 R16.2 155.81,53.95 154.08,55.68 v154.08,58.71
  Bottom 0.406: v147.79,64.97 154.05,58.71 v154.08,58.71
N$18
  Top 0.406: TX1.A RSCL1.2
N$19
  Top 0.406: TX2.A RSCL3.2
N$20  (via drill 0.25 pad 0.25)
  Top 0.406: U5.6 147.74,66.26 v147.76,66.28 | R15.2 155.21,56.81 v155.21,58.69
  Bottom 0.406: v147.76,66.28 147.76,66.14 v155.21,58.69
N$21  (via drill 0.25 pad 0.25)
  Top 0.406: v144.42,68.8 U5.4
  Bottom 0.406: R9.2 142.92,67.3 v144.42,68.8
N$22
  Top 0.406: U4.15 9.2,35.31 10.94,35.31 12.66,32.72 12.66,28.03 R17.2
N$23
  Top 0.406: U4.1 18.52,34.06 R18.2
N$24
  Top 0.406: U4.2 18.31,35.34 R19.2
N$25
  Top 0.406: U4.3 18.02,36.6 R20.2
N$26
  Top 0.406: U4.7 16.53,41.69 18.01,43.16 18.51,43.16 R26.2
N$27
  Top 0.406: U4.6 16.62,40.41 17.77,41.56 18.43,41.56 R23.2
N$28
  Top 0.406: U4.4 17.12,37.88 17.85,38.6 18.5,38.6 R21.2
N$29  (via drill 0.25 pad 0.25)
  Top 0.406: U5.5 147.93,67.53 v147.75,67.54 | R14.2 156.53,58.92 v155.36,60.09
  Bottom 0.406: v147.75,67.54 147.75,67.49 v155.36,60.09
N$51
  Bottom 0.406: L2.A 96.71,62.57 R25.1
N$56  (1 unrouted)
N$57  (1 unrouted)
N$117
  Bottom 0.406: RC1.1 69.61,46.77 OC1.1
N$317
  Top 0.406: R3.2 13.6,68.36 Q3.1 14.87,69.63 R93.2
PS1  (via drill 0.25 pad 0.25)  (1 unrouted)
  Top 0.305: 17.17,25.31 21.06,29.4 60.02,29.41 61.31,28.12 61.31,20 62.69,18.62
  Top 0.406: R1.2 93.63,1.77 v93.53,1.67 | PS1.4 17.17,25.31 | 62.69,18.62 63.68,18.62 PD1.1
  Bottom 0.406: v93.53,1.67 81.79,1.67 64.69,18.77 63.83,18.77 PD1.1
PS2  (2 unrouted)
  Top 0.305: 144.64,18.72 143.23,20.13 143.23,28.37 142.37,29.5 103.04,29.43 101.77,29.46 98.31,26.04 R2.2
  Top 0.406: PD2.1 144.64,18.72
PWM1  (2 unrouted)
PWM1#  (1 unrouted)
PWM2  (via drill 0.25 pad 0.25)  (1 unrouted)
  Top 0.406: OC3.13 88.88,28.5 89.82,27.57 89.82,22.55 v88.75,21.48 | v86.42,21.48 86.42,20.89 85.85,20.32 76.34,20.32 75.5,21.16 75.5,21.48 RM12.1
  Bottom 0.406: v88.75,21.48 v86.42,21.48
PWM2#  (1 unrouted)
RD+  (via drill 0.25 pad 0.25)  (1 unrouted)
  Top 0.406: RP3A.1 95.24,5.47 v95.66,5.05
  Bottom 0.406: v95.66,5.05 101.53,5.05 101.57,5.09
RD-  (1 unrouted)
RESET  (via drill 0.25 pad 0.25, 0.6)  (2 unrouted)
  Top 0.406: R6.1 140.92,71.36 v140.86,71.3 | R8.1 R14.1 158.32,57.3 v158.32,57.33 158.3,57.27 R15.1 R16.1 R5.1 | R12.2 v70.82,41.25 v70.81,41.26 | v76.72,41.33 U1.13 | v100.31,56.79 102.6,54.5 102.6,40.86 102.03,40.29 94.04,40.29 94.03,40.28 v79.68,40.28
  Bottom 0.406: 157.21,57.34 156.56,57.34 | 157.21,57.34 v158.32,57.33 | v140.86,71.3 140.86,70.06 R7.1 140.98,67.33 R9.1 | R9.1 141.08,67.18 141.08,66.11 149.85,57.34 157.21,57.34 | v70.81,41.26 76.68,41.26 76.68,41.29 v76.72,41.33 77.77,40.28 v79.68,40.28 | R9.1 135.59,72.67 112.68,72.67 100.31,60.3 v100.31,56.79
RESET1
  Top 0.406: U4.5 17.2,39.15 18.03,39.97 18.37,39.97 R22.2
RFID-EN1  (via drill 0.25 pad 0.25)
  Top 0.406: v74.61,43.39 75.53,43.39 U1.12
  Bottom 0.305: RF1.1 66.43,45.57 67.14,44.93 69.77,44.93 71.3,43.3 v74.61,43.39
RFID-EN2
  Top 0.406: 145.3,45.6 RF2.1 145.3,45.6 | U1.30 90.97,50.4 111.77,71.2 133.84,71.2 145.3,59.74 145.3,45.6
RFID-TX1  (1 unrouted)
RFID-TX2
  Top 0.406: RF2.4 145.15,37.77 144.67,37.77 142.59,39.85 142.59,57.78 142.6,57.79 142.6,59.74 132.07,70.27 112.12,70.27 90.65,48.8 U1.28
SCK  (via drill 0.25 pad 0.25)  (2 unrouted)
  Top 0.406: 4.96,43.75 JP3.8 4.99,43.75 v8.91,47.67 | v17.19,49.24 17.25,49.3 17.25,66.4 21.31,70.46 54.27,70.46 v58.83,65.9 | U1.9 67.41,46.4 65.42,48.39 65.42,62.01 v62.32,65.11
  Bottom 0.406: v8.91,47.67 10.48,49.24 v17.19,49.24 | v58.83,65.9 61.53,65.9 v62.32,65.11
SCL  (1 unrouted)
SDA  (1 unrouted)
SERIAL_OUT1  (via drill 0.25 pad 0.25)
  Top 0.406: U5.14 152.28,70.11 151.27,70.11 147.45,73.93 112.24,73.93 111.48,73.93 v107.28,69.7 | v97.9,63.17 97.87,63.14 67.76,63.14 57.57,73.33 5.27,73.33 1.91,69.97 1.91,58.75 7.24,53.42 v7.24,53.03 | 9.15,42.93 U4.9 7.27,42.95 v7.26,42.94
  Bottom 0.406: v7.26,42.94 7.26,53.01 v7.24,53.03 | v97.9,63.17 100.75,63.17 v107.28,69.7
SNSA  (1 unrouted)
SNSB
  Bottom 0.406: IC3.P$19 90.49,26 92.02,24.47 RSENB1.1
SPI-SS  (via drill 0.25 pad 0.25)  (1 unrouted)
  Top 0.406: R17.1 20.24,32.58 R18.1 R19.1 R20.1 R21.1 R22.1 R23.1 R26.1 20.24,45.52 20.24,45.53 v20.24,45.51 v20.25,45.5 | v62.4,66.43 66.5,62.23 66.5,48.55 67.85,47.2 U1.8
  Bottom 0.406: v20.25,45.5 20.25,67.41 25.24,72.4 56.27,72.4 v62.4,66.43
SR_CLOCK  (1 unrouted)
  Top 0.406: U5.11 150.92,66.26 150.54,65.88 150.54,48.72 158.08,41.18 160.11,41.18 JP2.7 | U4.11 5.69,40.41 JP3.7
SR_LATCH  (1 unrouted)
  Top 0.406: U5.12 150.38,67.53 149.79,66.94 149.79,46.74 157.82,38.71 160.1,38.71 JP2.6 | JP3.6 5.37,39.15 U4.12
SR_SERIAL_IN1  (1 unrouted)
  Top 0.406: JP3.5 5.37,36.6 U4.14
UCAP
  Top 0.406: U1.6 71.61,48.8 C5.1
VMOT  (via drill 0.25 pad 0.25)  (1 unrouted)
  Top 0.305: v110.1,30.36 v113.48,30.36 | JP3.2 4.94,28.55 6.89,28.55 9.98,25.46 15.43,25.46 19.37,29.4 v19.46,29.4 | v63.06,29.4 63.1,29.44 v63.1,34.67
  Top 0.406: JP2.2 160.1,28.55 159.15,28.55 157.21,26.61 MOT-PWR-1.P1 152.84,16.66 C1.2 | IC2.3 v150.91,8.08 v150.91,8.09 | v150.98,15.15 150.9,15.23 C1.2 | C1.2 150.9,18.55 148.83,20.62 v148.83,24.41
  Bottom 0.305: 147.15,24.41 142.18,29.5 114.46,29.47 | v113.48,30.36 114.04,29.87 | 103.19,29.54 109.51,29.54 110.1,30.13 | v19.46,29.4 v63.06,29.4 | D14.P$1 66.43,34.67 v63.1,34.67
  Bottom 0.406: v150.91,8.09 150.92,8.13 v150.98,15.15 | v148.83,24.41 147.15,24.41 | 114.46,29.47 114.37,29.55 114.04,29.87 | 110.1,30.13 v110.1,30.36 | D16.P$1 97.39,23.52 D13.P$1 101.58,23.66 102.43,24.51 102.43,28.78 103.19,29.54 | D14.P$1 71.67,34.62 D15.P$1 71.7,33.97 74.67,31 76.11,31 IC3.P$6
VUSBD
  Top 0.406: JP1.VBUS 83.04,17.62 80.59,17.62 79.41,16.44 79.41,7.41 77.88,5.88 F2.1 81.47,1.71 C14.+
XTAL1  (1 unrouted)
  Top 0.406: Y3.3 83.33,39.09 C13.2
XTAL2  (1 unrouted)
  Top 0.406: C12.2 78.52,37.33 Y3.1

### Text on the board
tPlace: CAN_MAIN_MB_V18_R4
bPlace: CAN_MAIN_MB_V18_R4
tNames: + | This is pin 1
tValues: BC817 | BC817